# EAGLE board EEG_v3_16 (EAGLE 9.6.2), part 1 of 2
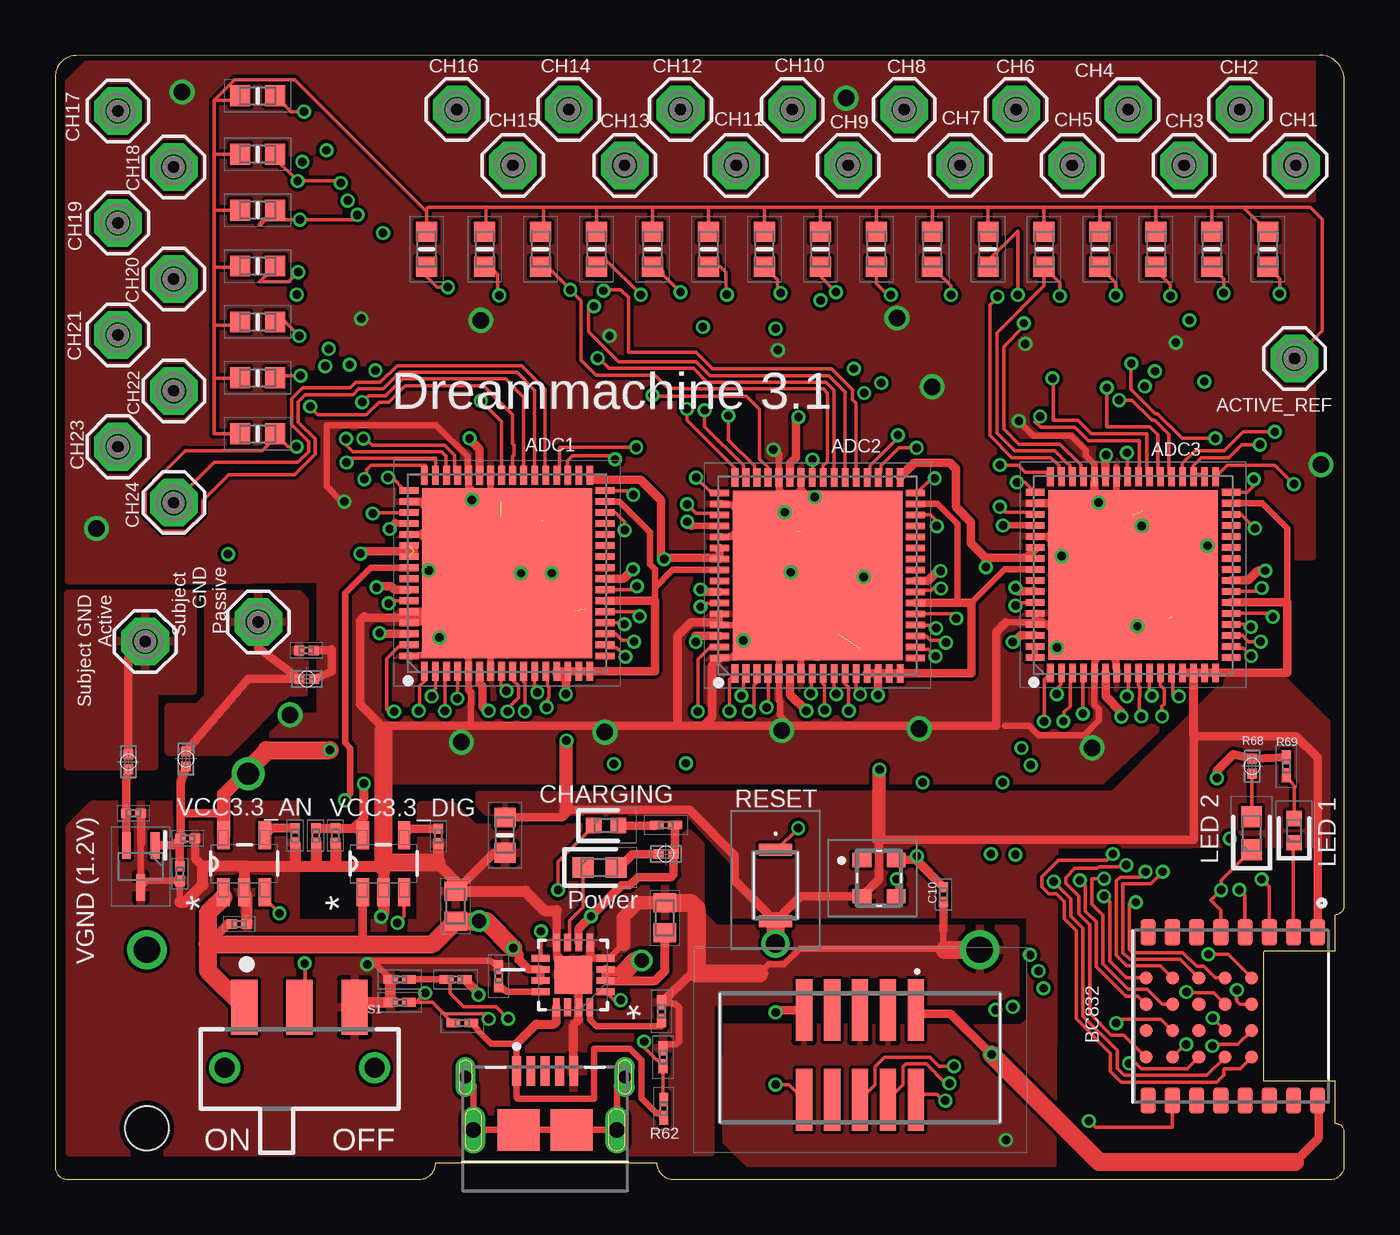
[diagram p2: board, top side]
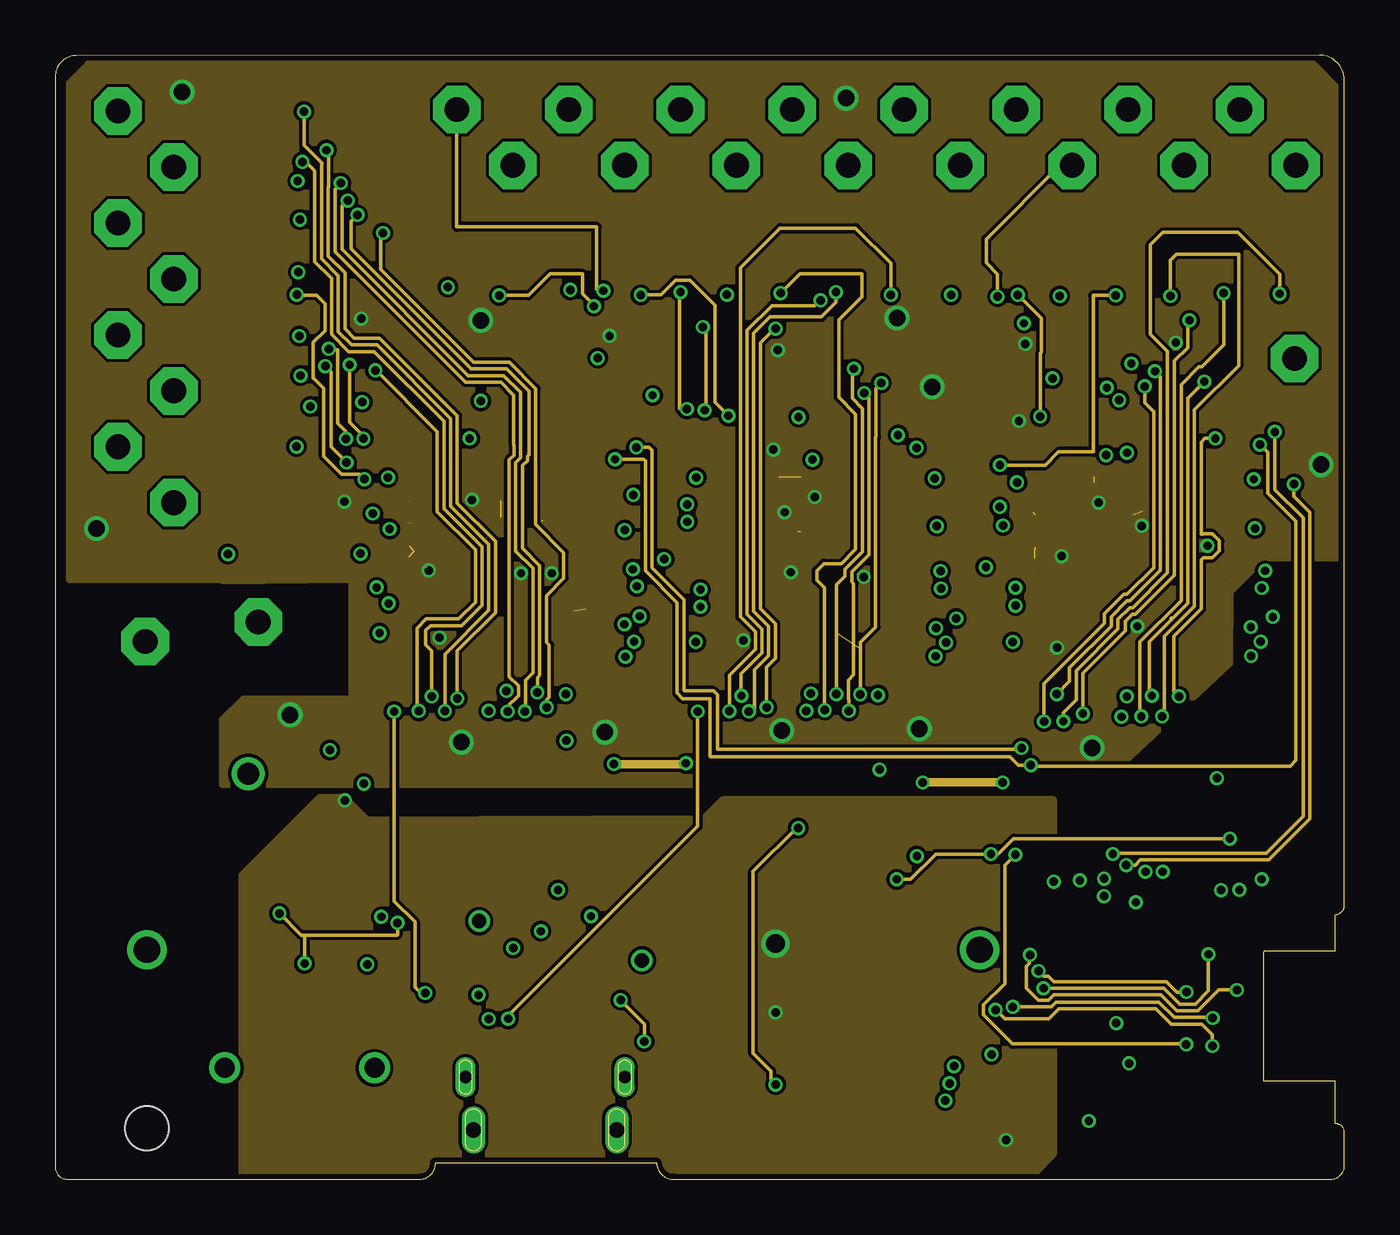
[diagram p3: board, inner layer Route2]
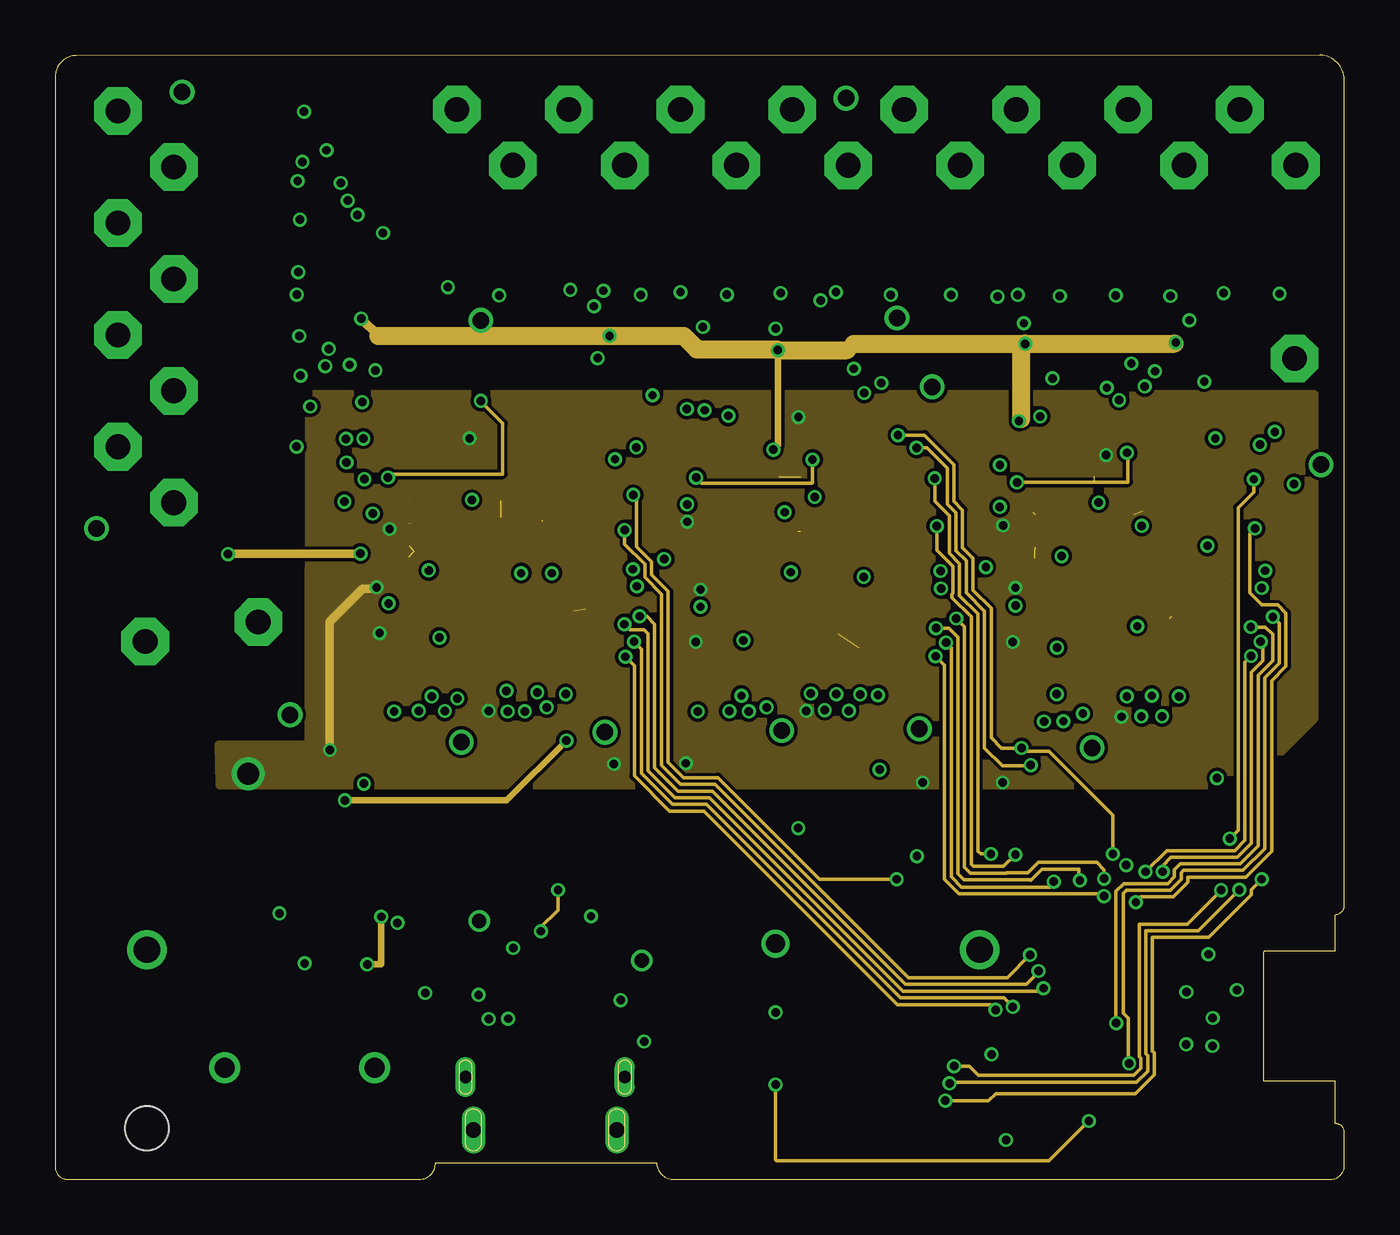
[diagram p4: board, inner layer Route15]
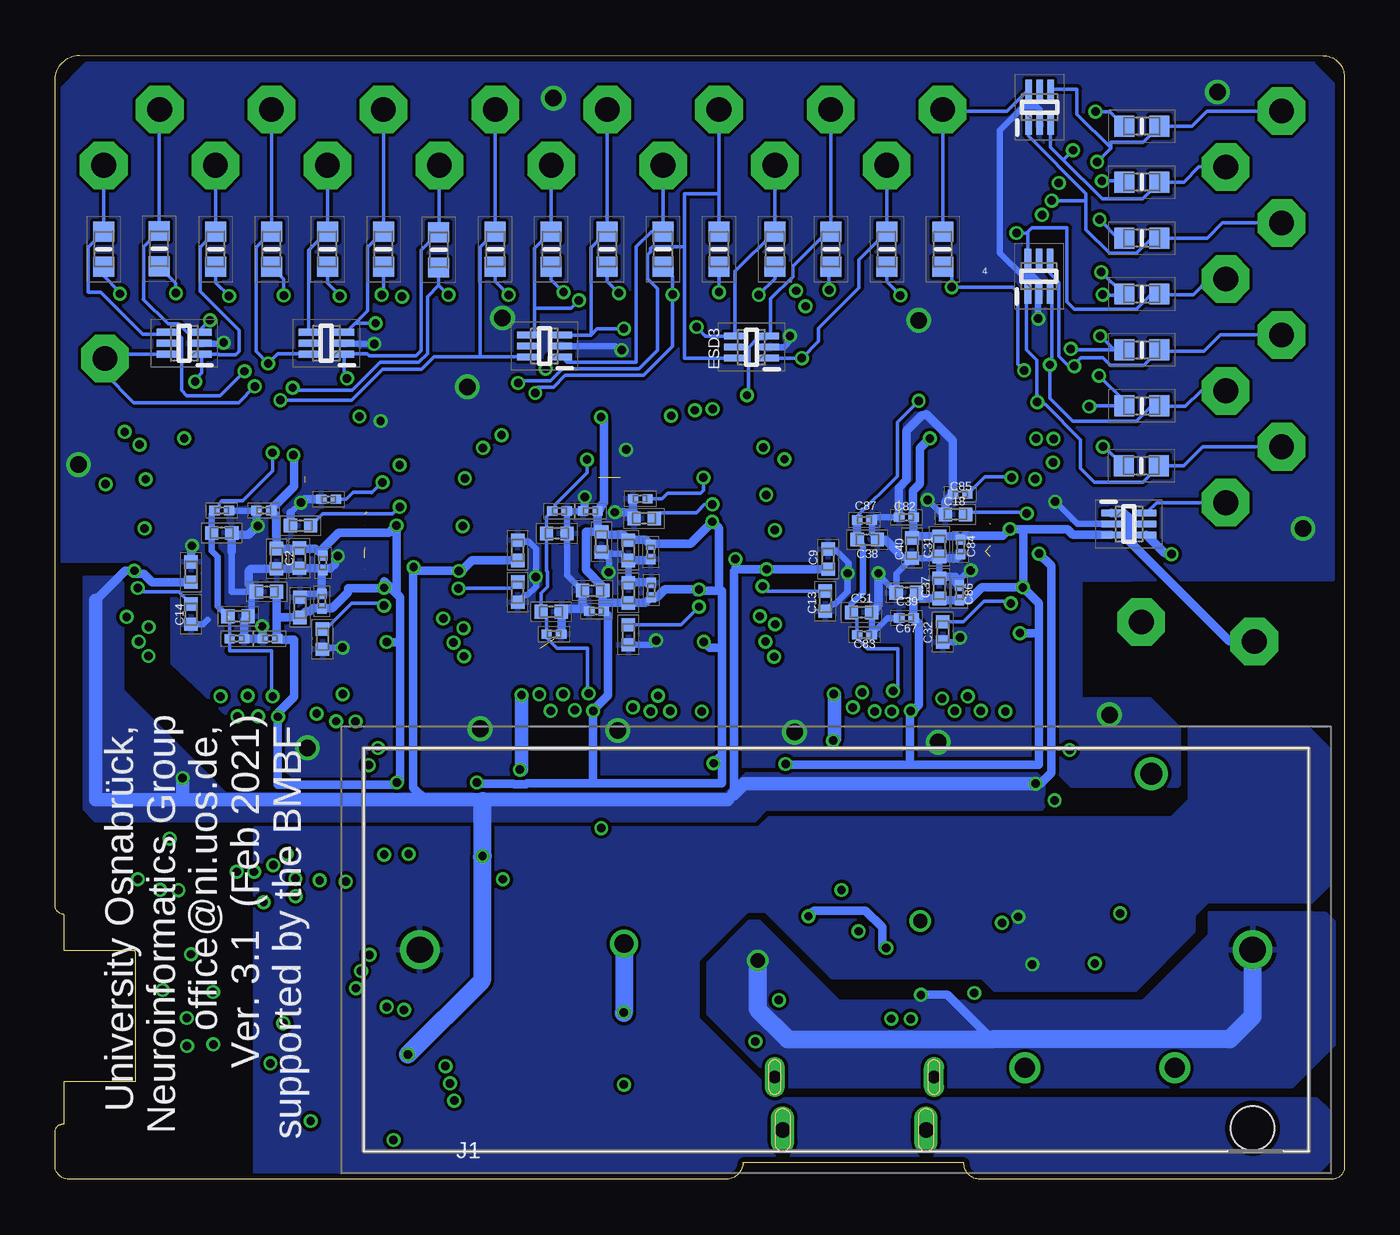
[diagram p5: board, bottom side, seen from below]

Size 58.55 x 51.03 mm. Coordinates in mm from the lower left corner, seen from the top.
Outline: 0,0.64 arc90 0.49,0 16.57,0 arc90 17.28,0.74 27.31,0.74 arc90 28.12,0 57.89,0 arc90 58.55,0.58 58.55,2.2 arc80 58.14,2.52 58.14,4.45 54.89,4.45 54.89,10.26 54.92,10.36 58.14,10.36 58.14,12.01 arc90 58.55,12.45 58.55,49.81 arc90 57.46,51.03 57.43,51.03 0.97,51 arc90 0,50.04 0,0.64
Copper layers (1+2*15+16): Top 0.018mm / dielectric 0.36mm / Route2 0.035mm / dielectric 0.71mm / Route15 0.035mm / dielectric 0.2mm / Bottom 0.018mm
Design rules "eC_4Layer_PClass6_BaseCopperO18-I35_eCDefault *": minimum track width 0.15mm, minimum drill 0.35mm, track to track 0.15mm, track to pad 0.15mm, pad to pad 0.15mm, via to via 0.15mm, smd to smd 0mil, copper to edge 0.25mm, drill to drill 0.35mm, minimum pad ring 0.175mm, minimum via ring 0.125mm, stop-mask expansion 0mil, vias tented up to drill 0.45mm, thermal gap 0.2mm
Net classes: 0 default: width 0.152 mm, drill 0.381 mm; 1 power: width 0.305 mm, drill 0.381 mm; 2 power2: width 0.381 mm, drill 0.381 mm

## Footprints (pad centres in the part's own frame; a part is rotated, then mirrored left to right if it is on the bottom)
SE11 = drill 1.118 pad 2.159 octagon: MP 0,0
QFN50P900X900X80-65N = smd 0.85 x 0.3: 1 -4.45,3.75; 2 -4.45,3.25; 3 -4.45,2.75; 4 -4.45,2.25; 5 -4.45,1.75; 6 -4.45,1.25; 7 -4.45,0.75; 8 -4.45,0.25; 9 -4.45,-0.25; 10 -4.45,-0.75; 11 -4.45,-1.25; 12 -4.45,-1.75; 13 -4.45,-2.25; 14 -4.45,-2.75; 15 -4.45,-3.25; 16 -4.45,-3.75; 33 4.45,-3.75; 34 4.45,-3.25; 35 4.45,-2.75; 36 4.45,-2.25; 37 4.45,-1.75; 38 4.45,-1.25; 39 4.45,-0.75; 40 4.45,-0.25; 41 4.45,0.25; 42 4.45,0.75; 43 4.45,1.25; 44 4.45,1.75; 45 4.45,2.25; 46 4.45,2.75; 47 4.45,3.25; 48 4.45,3.75 | smd 0.3 x 0.85: 17 -3.75,-4.45; 18 -3.25,-4.45; 19 -2.75,-4.45; 20 -2.25,-4.45; 21 -1.75,-4.45; 22 -1.25,-4.45; 23 -0.75,-4.45; 24 -0.25,-4.45; 25 0.25,-4.45; 26 0.75,-4.45; 27 1.25,-4.45; 28 1.75,-4.45; 29 2.25,-4.45; 30 2.75,-4.45; 31 3.25,-4.45; 32 3.75,-4.45; 49 3.75,4.45; 50 3.25,4.45; 51 2.75,4.45; 52 2.25,4.45; 53 1.75,4.45; 54 1.25,4.45; 55 0.75,4.45; 56 0.25,4.45; 57 -0.25,4.45; 58 -0.75,4.45; 59 -1.25,4.45; 60 -1.75,4.45; 61 -2.25,4.45; 62 -2.75,4.45; 63 -3.25,4.45; 64 -3.75,4.45 | smd 7.7 x 7.7: 65 0,0
XCVR_BC832 = smd 1.19 x 0.69: 1 -3.82,3.918; 2 -3.82,2.818; 3 -3.82,1.718; 4 -3.82,0.618; 5 -3.82,-0.482; 6 -3.82,-1.582; 7 -3.82,-2.682; 8 -3.82,-3.782; 9 3.82,-3.782; 10 3.82,-2.682; 11 3.82,-1.582; 12 3.82,-0.482; 13 3.82,0.618; 14 3.82,1.718; 15 3.82,2.818; 16 3.82,3.918 | smd 0.6 x 0.6: A1 -1.75,0.919; A2 -1.75,-0.281; A3 -1.75,-1.481; A4 -1.75,-2.681; A5 -1.75,-3.881; B1 -0.55,0.919; B2 -0.55,-0.281; B3 -0.55,-1.481; B4 -0.55,-2.681; B5 -0.55,-3.881; C1 0.65,0.919; C2 0.65,-0.281; C3 0.65,-1.481; C4 0.65,-2.681; C5 0.65,-3.881; D1 1.85,0.919; D2 1.85,-0.281; D3 1.85,-1.481; D4 1.85,-2.681; D5 1.85,-3.881
CAPC1005X33N = smd 0.6 x 0.62: 1 -0.46,0; 2 0.46,0
CAPC0603X33N = smd 0.46 x 0.42: 1 -0.33,0; 2 0.33,0
CAPC1608X100N = smd 0.87 x 1.02: 1 -0.68,0; 2 0.68,0
QFN50P300X300X100-17N = smd 0.813 x 0.305: 1 -1.473,0.762; 2 -1.473,0.254; 3 -1.473,-0.254; 4 -1.473,-0.762; 9 1.473,-0.762; 10 1.473,-0.254; 11 1.473,0.254; 12 1.473,0.762 | smd 0.305 x 0.813: 5 -0.762,-1.473; 6 -0.254,-1.473; 7 0.254,-1.473; 8 0.762,-1.473; 13 0.762,1.473; 14 0.254,1.473; 15 -0.254,1.473; 16 -0.762,1.473 | smd 1.702 x 1.702: 17 0,0
DSC1001DI50081920T = smd 0.85 x 0.65: 1 -0.775,0.825; 2 -0.775,-0.825; 3 0.775,-0.825; 4 0.775,0.825
SOT65P210X110-3N = smd 1.2 x 0.4: 1 -0.95,0.65; 2 -0.95,-0.65; 3 0.95,0
SOP50P160X60-6N = smd 0.914 x 0.3: 1 -0.798,0.5 | smd 0.904 x 0.3: 2 -0.798,0; 3 -0.798,-0.5; 4 0.798,-0.5; 5 0.798,0; 6 0.798,0.5
SHF-105-01-X-D-SM-TR = smd 0.74 x 2.795: 1 -2.54,-2.033; 2 -2.54,2.033; 3 -1.27,-2.033; 4 -1.27,2.033; 5 0,-2.033; 6 0,2.033; 7 1.27,-2.033; 8 1.27,2.033; 9 2.54,-2.033; 10 2.54,2.033
TE_2040002-1 = smd 0.4 x 1.35: 1 -1.3,2.675; 2 -0.65,2.675; 3 0,2.675; 4 0.65,2.675; 5 1.3,2.675 | smd 1.9 x 1.9: S4 -1.2,0; S5 1.2,0 | drill 0.56 long: SH1 -3.615,2.4; SH2 3.615,2.4 | drill 0.71 long: SH3 3.255,0; SH4 -3.255,0
LEDC1006X25N = smd 0.7 x 0.7: 1 -0.55,0; 2 0.55,0
LEDC1608X80N = smd 0.95 x 0.95: 1 -0.75,0; 2 0.75,0
RESC1608X55N = smd 0.9 x 0.95: 1 -0.8,0; 2 0.8,0
RESC0603X26N = smd 0.44 x 0.42: 1 -0.34,0; 2 0.34,0
RESC0603X26N' = smd 0.625 x 0.4: 1 -0.412,0; 2 0.412,0
RESC0603X28N = smd 0.625 x 0.4: 1 -0.412,0; 2 0.412,0
TL3780AF330QG = smd 0.55 x 1.5: 1 -1.625,0; 2 1.625,0
JS102011SAQN = smd 1.2 x 2.5: 1 -2.5,1; 2 0,1; 3 2.5,1 | drill 0.9 pad 1.4: 4 -3.4,-1.75; 5 3.4,-1.75
1051 = drill 1.19 pad 1.785: 1 0,0; 2 37.82,0 | hole 1.98: 0,8.1
SOT95P280X145-5N = smd 1.27 x 0.559: 1 -1.295,0.94; 2 -1.295,0; 3 -1.295,-0.94; 4 1.295,-0.94; 5 1.295,0.94

## Placement (x,y rotation side)
ACTIVE_REF  SE11  [SE11]  56.29,37.26 0 top
ADC1  AD7779ACPZ  [QFN50P900X900X80-65N]  20.53,27.51 90 top
ADC2  AD7779ACPZ  [QFN50P900X900X80-65N]  34.62,27.41 90 top
ADC3  AD7779ACPZ  [QFN50P900X900X80-65N]  48.95,27.43 90 top
BC832  BC832  [XCVR_BC832]  53.42,7.39 270 top
C1  1 uF  [CAPC1005X33N]  46.41,24.51 270 bottom
C2  1 uF  [CAPC1005X33N]  47.45,28.19 90 bottom
C3  2.2uF  [CAPC0603X33N]  12.73,15.6 90 top
C4  1 uF  [CAPC1005X33N]  52.38,27.56 90 bottom
C5  0.01uF  [CAPC0603X33N]  17.4,15.57 90 top
C6  1 uF  [CAPC1005X33N]  37.55,28.55 90 bottom
C7  1 uF  [CAPC1005X33N]  47.4,29.67 180 bottom
C8  1 uF  [CAPC1005X33N]  50.98,29.34 0 bottom
C9  1 uF  [CAPC1005X33N]  23.45,28.14 90 bottom
C10  0.01uF  [CAPC0603X33N]  40.34,12.93 90 top
C11  1 uF  [CAPC1005X33N]  47.43,25.96 90 bottom
C12  1 uF  [CAPC1005X33N]  37.55,26.65 90 bottom
C13  1 uF  [CAPC1005X33N]  23.58,26.24 90 bottom
C14  1 uF  [CAPC1005X33N]  52.38,25.65 270 bottom
C15  1 uF  [CAPC1005X33N]  31.81,30 180 bottom
C16  1 uF  [CAPC1005X33N]  48.95,26.67 0 bottom
C17  1 uF  [CAPC1005X33N]  48.49,28.17 90 bottom
C18  1 uF  [CAPC1005X33N]  17.66,30.18 180 bottom
C19  2.2uF  [CAPC0603X33N]  8.36,11.58 180 top
C20  0.1 uF  [CAPC0603X33N]  11.84,15.6 90 top
C21  1 uF  [CAPC1005X33N]  50.25,25.55 180 bottom
C22  2.2uF  [CAPC0603X33N]  3.56,16.61 180 top
C23  2.2uF  [CAPC0603X33N]  5.67,13.87 90 top
C24  1 uF  [CAPC1005X33N]  34.14,26.72 0 bottom
C25  1 uF  [CAPC1005X33N]  32.52,28.55 90 bottom
C26  1 uF  [CAPC1005X33N]  32.52,24.72 270 bottom
C27  1 uF  [CAPC1005X33N]  35.77,29.31 0 bottom
C28  1 uF  [CAPC1005X33N]  32.52,26.62 90 bottom
C29  1 uF  [CAPC1005X33N]  36.02,25.76 180 bottom
C30  1 uF  [CAPC1005X33N]  33.74,28.93 90 bottom
C31  1 uF  [CAPC1005X33N]  18.39,28.73 90 bottom
C32  1 uF  [CAPC1005X33N]  18.24,24.84 270 bottom
C33  2.2uF  [CAPC0603X33N]  11.41,24 180 top
C37  1 uF  [CAPC1005X33N]  18.39,26.82 90 bottom
C38  1 uF  [CAPC1005X33N]  21.67,29.03 0 bottom
C39  1 uF  [CAPC1005X33N]  19.89,26.62 0 bottom
C40  1 uF  [CAPC1005X33N]  19.64,28.65 90 bottom
C51  1 uF  [CAPC1005X33N]  21.92,25.73 180 bottom
C55  10 uF  [CAPC1608X100N]  27.69,11.86 270 top
C56  10 uF  [CAPC1608X100N]  18.19,12.4 270 top
C57  0.01uF  [CAPC0603X33N]  10.9,15.6 270 top
C64  0.1 uF  [CAPC0603X33N]  35.89,24.74 180 bottom
C65  0.1 uF  [CAPC0603X33N]  46.13,30.86 0 bottom
C66  0.1 uF  [CAPC0603X33N]  46.44,26.24 90 bottom
C67  0.1 uF  [CAPC0603X33N]  19.89,25.48 0 bottom
C68  0.1 uF  [CAPC0603X33N]  46.39,27.97 90 bottom
C69  0.1 uF  [CAPC0603X33N]  49.08,30.35 0 bottom
C70  0.1 uF  [CAPC0603X33N]  50.3,24.54 180 bottom
C71  0.1 uF  [CAPC0603X33N]  35.64,30.33 0 bottom
C72  0.1 uF  [CAPC0603X33N]  33.96,25.78 0 bottom
C73  0.1 uF  [CAPC0603X33N]  34.24,30.33 0 bottom
C74  0.1 uF  [CAPC0603X33N]  31.98,30.89 0 bottom
C75  0.1 uF  [CAPC0603X33N]  6.02,15.47 180 top
C77  0.1 uF  [CAPC0603X33N]  31.5,28.47 90 bottom
C78  0.1 uF  [CAPC0603X33N]  31.48,26.75 90 bottom
C79  0.1 uF  [CAPC0603X33N]  48.8,24.54 0 bottom
C81  0.1 uF  [CAPC0603X33N]  50.98,30.35 0 bottom
C82  0.1 uF  [CAPC0603X33N]  19.89,30.05 0 bottom
C83  0.1 uF  [CAPC0603X33N]  21.8,24.72 180 bottom
C84  0.1 uF  [CAPC0603X33N]  17.43,28.7 90 bottom
C85  0.1 uF  [CAPC0603X33N]  17.45,31.09 0 bottom
C86  0.1 uF  [CAPC0603X33N]  17.48,26.62 90 bottom
C87  0.1 uF  [CAPC0603X33N]  21.8,29.92 0 bottom
CH1  SE11  [SE11]  56.34,46.03 0 top
CH2  SE11  [SE11]  53.8,48.57 0 top
CH3  SE11  [SE11]  51.26,46.03 0 top
CH4  SE11  [SE11]  48.72,48.57 0 top
CH5  SE11  [SE11]  46.18,46.03 0 top
CH6  SE11  [SE11]  43.64,48.57 0 top
CH7  SE11  [SE11]  41.1,46.03 0 top
CH8  SE11  [SE11]  38.56,48.57 0 top
CH9  SE11  [SE11]  36.02,46.03 0 top
CH10  SE11  [SE11]  33.48,48.57 0 top
CH11  SE11  [SE11]  30.94,46.03 0 top
CH12  SE11  [SE11]  28.4,48.57 0 top
CH13  SE11  [SE11]  25.86,46.03 0 top
CH14  SE11  [SE11]  23.32,48.57 0 top
CH15  SE11  [SE11]  20.78,46.03 0 top
CH16  SE11  [SE11]  18.24,48.57 0 top
CH17  SE11  [SE11]  2.85,48.49 0 top
CH18  SE11  [SE11]  5.39,45.95 0 top
CH19  SE11  [SE11]  2.85,43.41 0 top
CH20  SE11  [SE11]  5.39,40.87 0 top
CH21  SE11  [SE11]  2.85,38.33 0 top
CH22  SE11  [SE11]  5.39,35.79 0 top
CH23  SE11  [SE11]  2.85,33.25 0 top
CH24  SE11  [SE11]  5.39,30.71 0 top
CHARGING  BQ24072TRGTR  [QFN50P300X300X100-17N]  23.53,9.27 180 top
CLOCK  DSC1001DI5-008.1920T  [DSC1001DI50081920T]  37.42,13.67 0 top
D1  REF3312AIDCKR  [SOT65P210X110-3N]  3.89,14.2 270 top
ESD1  TPD4E1B06DRLR  [SOP50P160X60-6N]  13.87,41 90 bottom
ESD2  TPD4E1B06DRLR  [SOP50P160X60-6N]  13.85,48.67 90 bottom
ESD3  TPD4E1B06DRLR  [SOP50P160X60-6N]  26.93,37.77 180 bottom
ESD4  TPD4E1B06DRLR  [SOP50P160X60-6N]  36.33,37.82 180 bottom
ESD5  TPD4E1B06DRLR  [SOP50P160X60-6N]  46.23,37.95 180 bottom
ESD6  TPD4E1B06DRLR  [SOP50P160X60-6N]  52.68,37.95 180 bottom
ESD7  TPD4E1B06DRLR  [SOP50P160X60-6N]  9.78,29.74 0 bottom
J1  SHF-105-01-L-D-SM-TR  [SHF-105-01-X-D-SM-TR]  36.56,5.64 180 top
J3  2040002-1  [TE_2040002-1]  22.26,2.24 0 top
LED1  SML-P11MTT86R  [LEDC1006X25N]  56.27,15.83 90 top
LED2  SML-P11MTT86R  [LEDC1006X25N]  25.02,16.05 0 top
LED3  150060RS75000  [LEDC1608X80N]  54.34,15.7 90 top
LED4  150060RS75000  [LEDC1608X80N]  24.72,14.15 0 top
R1  0 Ohm  [RESC1608X55N]  23.32,42.22 270 bottom
R2  0 Ohm  [RESC1608X55N]  9.22,32.39 180 bottom
R3  0 Ohm  [RESC1608X55N]  9.2,35.1 180 bottom
R4  0 Ohm  [RESC1608X55N]  9.2,37.64 180 bottom
R5  0 Ohm  [RESC1608X55N]  9.2,40.18 180 bottom
R6  0 Ohm  [RESC1608X55N]  9.2,42.72 180 bottom
R7  0 Ohm  [RESC1608X55N]  9.2,45.26 180 bottom
R8  0 Ohm  [RESC1608X55N]  9.2,47.8 180 bottom
R9  0 Ohm  [RESC1608X55N]  18.24,42.22 270 bottom
R10  0 Ohm  [RESC1608X55N]  20.78,42.22 270 bottom
R11  0 Ohm  [RESC1608X55N]  25.86,42.22 270 bottom
R12  0 Ohm  [RESC1608X55N]  28.4,42.22 270 bottom
R13  0 Ohm  [RESC1608X55N]  30.94,42.22 270 bottom
R14  0 Ohm  [RESC1608X55N]  33.48,42.22 270 bottom
R15  0 Ohm  [RESC1608X55N]  36.02,42.22 270 bottom
R16  0 Ohm  [RESC1608X55N]  38.56,42.22 270 bottom
R17  0 Ohm  [RESC1608X55N]  41.13,42.19 270 bottom
R18  0 Ohm  [RESC1608X55N]  43.64,42.22 270 bottom
R19  0 Ohm  [RESC1608X55N]  46.18,42.22 270 bottom
R20  0 Ohm  [RESC1608X55N]  48.72,42.22 270 bottom
R21  0 Ohm  [RESC1608X55N]  51.26,42.22 270 bottom
R22  0 Ohm  [RESC1608X55N]  53.83,42.24 270 bottom
R23  0 Ohm  [RESC1608X55N]  56.34,42.22 270 bottom
R24  0 Ohm  [RESC1608X55N]  55.07,42.22 270 top
R25  0 Ohm  [RESC1608X55N]  52.53,42.22 270 top
R26  0 Ohm  [RESC1608X55N]  49.99,42.22 270 top
R27  0 Ohm  [RESC1608X55N]  47.45,42.22 270 top
R28  0 Ohm  [RESC1608X55N]  44.91,42.22 270 top
R29  0 Ohm  [RESC1608X55N]  42.37,42.22 270 top
R30  0 Ohm  [RESC1608X55N]  39.83,42.22 270 top
R31  0 Ohm  [RESC1608X55N]  37.29,42.22 270 top
R32  0 Ohm  [RESC1608X55N]  34.75,42.22 270 top
R33  0 Ohm  [RESC1608X55N]  32.21,42.22 270 top
R34  0 Ohm  [RESC1608X55N]  29.67,42.22 270 top
R35  0 Ohm  [RESC1608X55N]  27.13,42.22 270 top
R36  0 Ohm  [RESC1608X55N]  24.59,42.22 270 top
R37  0 Ohm  [RESC1608X55N]  22.05,42.22 270 top
R38  0 Ohm  [RESC1608X55N]  19.51,42.22 270 top
R39  0 Ohm  [RESC1608X55N]  20.43,15.62 270 top
R40  0 Ohm  [RESC1608X55N]  16.87,42.22 270 top
R41  2.7 kohm  [RESC0603X26N]  27.74,14.76 0 top
R42  0 Ohm  [RESC1608X55N]  9.2,49.18 0 top
R43  2 kohm  [RESC0603X26N']  27.74,16.08 0 top
R44  0 Ohm  [RESC1608X55N]  9.2,46.53 0 top
R45  300 Ohm  [RESC0603X26N]  3.33,18.95 270 top
R46  0 Ohm  [RESC1608X55N]  9.2,43.99 0 top
R47  300 Ohm  [RESC0603X26N]  5.95,19.08 90 top
R48  0 Ohm  [RESC1608X55N]  9.2,41.45 0 top
R49  41.2 kOhms  [RESC0603X28N]  15.65,8.03 180 top
R50  0 Ohm  [RESC1608X55N]  9.2,38.91 0 top
R51  2.2 kohm  [RESC0603X28N]  20.15,9.22 270 top
R52  0 Ohm  [RESC1608X55N]  9.2,36.37 0 top
R53  3 kohm  [RESC0603X26N']  27.54,7.62 270 top
R54  0 Ohm  [RESC1608X55N]  9.2,33.83 0 top
R55  41.2kOhms  [RESC0603X28N]  18.19,9.07 0 top
R56  41.2kOhms  [RESC0603X28N]  15.65,9.07 0 top
R57  41.2kOhms  [RESC0603X28N]  18.5,7.09 0 top
R58  300 Ohm  [RESC0603X26N]  11.43,22.71 0 top
R62  200kohm  [RESC0603X28N]  27.64,3.2 270 top
R65  49.9 kOhms  [RESC0603X28N]  27.61,5.54 270 top
R68  2.7kohm  [RESC0603X26N]  54.36,18.75 90 top
R69  2 kohm  [RESC0603X26N']  55.91,18.75 90 top
RESET  TL3780AF330QG  [TL3780AF330QG]  32.72,13.34 270 top
S1  JS102011SAQN  [JS102011SAQN]  11.1,6.81 0 top
SUBJECT_GND  SE11  [SE11]  4.09,24.41 0 top
SUBJECT_GND_VD  SE11  [SE11]  9.22,25.3 0 top
U2  1051  [1051]  4.17,10.41 180 bottom
VCC3.3_AN  TPS73233DBVT  [SOT95P280X145-5N]  8.59,14.33 90 top
VCC3.3_DIG  TPS73233DBVT  [SOT95P280X145-5N]  14.91,14.33 90 top

## Tracks (layer width: path | path; a pad name or v marks a point on that pad's centre or on a via)
-CHG  (via drill 0.38)
  Top 0.152: LED2.1 22.84,14.42 v22.84,13.13 22.84,13.03 | v22.06,11.26 22.06,10.05 CHARGING.9
  Route15 0.152: v22.84,13.13 22.84,12.22 22.03,11.41 22.03,11.3 v22.06,11.26
-PGOOD
  Top 0.152: LED4.1 23.97,12.34 23.36,11.73 23.36,10.84 CHARGING.7
ADC1_IN_0+  (via drill 0.38)
  Top 0.152: ADC3.2 45.67,22.96 45.67,22.46 45.47,22.25 45.47,22.04 v45.49,22.02
  Route2 0.152: v49.95,36.68 50.19,36.43 50.19,27.64 48.81,26.25 48.67,26.25 47.96,25.54 47.96,25.11 46.07,23.21 46.07,22.6 v45.49,22.02
  Bottom 0.152: CH1.MP R23.1 57.05,42.3 57.05,40.26 56.47,40.26 54.57,38.36 53.57,38.36 ESD6.4 53.06,38.45 52.8,38.19 52.8,35.8 52.56,35.56 51.06,35.56 v49.95,36.68
ADC1_IN_0-  (via drill 0.38)
  Top 0.152: ADC3.1 44.92,22.7 v44.92,20.79 v44.91,20.78 | R38.1 19.56,43.07 19.56,44.12 | 19.56,44.12 22.18,44.12 | 22.18,44.12 24.54,44.12 | 24.54,44.12 27.21,44.12 | 27.21,44.12 29.65,44.12 | 29.65,44.12 32.21,44.12 | 32.21,44.12 34.8,44.12 | 34.8,44.12 37.29,44.12 | 37.29,44.12 39.81,44.12 | 39.81,44.12 42.37,44.12 | 42.37,44.12 44.94,44.12 | 44.94,44.12 47.55,44.12 | 47.55,44.12 50.02,44.12 | 50.02,44.12 52.46,44.12 | 52.46,44.12 53.97,44.12 | 53.97,44.12 R24.1 | R37.1 22.18,43.14 22.18,44.12 | R36.1 24.59,44.07 24.54,44.12 | R35.1 27.13,44.04 27.21,44.12 | R34.1 29.67,44.09 29.65,44.12 | R33.1 32.21,44.12 | R32.1 34.75,44.07 34.8,44.12 | R31.1 37.29,44.12 | R30.1 39.83,44.09 39.81,44.12 | R29.1 42.37,44.12 | R28.1 44.91,44.09 44.94,44.12 | R27.1 47.45,44.02 47.55,44.12 | R26.1 49.99,44.09 50.02,44.12 | R25.1 52.53,44.04 52.46,44.12 | 53.97,44.12 57,44.12 57.54,43.59 57.54,38.51 ACTIVE_REF.MP | R42.1 8.2,48.97 7.22,48.97 | 7.22,46.61 7.22,48.97 | 7.22,46.61 7.22,43.99 | 7.22,43.99 7.22,41.4 | 7.22,41.4 7.22,38.76 | 7.22,38.76 7.22,36.35 | 7.22,36.35 7.22,33.83 R54.1 | R52.1 8.37,36.35 7.22,36.35 | R50.1 8.25,38.76 7.22,38.76 | R48.1 8.35,41.4 7.22,41.4 | R46.1 7.22,43.99 | R44.1 7.29,46.53 7.22,46.61 | 7.22,48.97 8.16,49.91 10.88,49.91 16.87,43.92 | 19.56,44.12 16.95,44.12 16.87,44.04 16.87,43.92 | 16.87,43.92 R40.1
  Route2 0.152: v49.48,35.99 49.48,35.25 49.89,34.84 49.89,27.76 48.68,26.55 48.55,26.55 47.66,25.66 47.66,25.23 44.91,22.48 v44.91,20.78
  Bottom 0.152: ESD6.6 56.1,37.45 ACTIVE_REF.MP 56.29,36.58 54.97,35.26 50.22,35.26 v49.48,35.99
ADC1_IN_1+  (via drill 0.38)
  Top 0.152: ADC3.4 46.67,22.96 v46.67,21.13
  Route2 0.152: v46.67,21.13 46.67,22.96 48.6,24.89 48.6,25.33 48.92,25.64 49.06,25.64 50.83,27.42 50.83,37.15 51.44,37.75 51.44,38.86 51.52,38.94 v51.52,38.99
  Bottom 0.152: 53.8,43.07 R22.1 | CH2.MP 53.83,48.54 R22.1 | v51.52,38.99 51.89,38.62 ESD6.3 52.56,38.45 52.94,38.82 53.41,38.82 54.54,39.95 54.53,39.96 54.53,42.34 R22.1
ADC1_IN_1-  (via drill 0.38)
  Top 0.152: ADC3.3 46.1,22.88 46.1,21.48 45.82,21.19 45.82,20.81 v45.79,20.79 | 55.07,41.61 R24.2 55.6,40.88 v55.6,40.19
  Route2 0.152: v45.79,20.79 45.79,21.18 46.11,21.49 46.37,21.76 46.37,23.09 48.26,24.98 48.26,25.41 48.8,25.95 48.93,25.95 50.51,27.53 50.51,37.59 49.74,38.36 49.74,42.42 50.3,42.98 53.71,42.98 55.6,41.08 v55.6,40.19
  Bottom 0.152: R23.2 56.34,41.01 55.6,40.27 v55.6,40.19
ADC1_IN_2+  (via drill 0.38)
  Top 0.152: ADC3.10 49.7,22.14 49.8,22.03 v49.8,21.95
  Route2 0.152: v49.8,21.95 49.7,22.05 49.7,24.41 51.44,26.14 51.44,35.46 v52.19,36.21
  Bottom 0.152: CH3.MP R21.1 51.96,42.31 51.96,40.3 50.19,38.53 50.19,37.59 50.35,37.43 51.12,37.43 51.13,37.45 ESD6.1 51.9,37.44 51.9,36.6 52.19,36.31 v52.19,36.21
ADC1_IN_2-  (via drill 0.38)
  Top 0.152: ADC3.9 49.2,22.41 49.26,22.35 49.26,21.9 49.23,21.87 49.23,20.9 v49.33,21.01 | R25.2 53.06,40.88 v53.06,40.22
  Route2 0.152: v49.33,21.01 49.26,21.01 49.26,24.39 51.13,26.26 51.13,36.07 51.94,36.88 52.07,36.88 53.06,37.87 v53.06,40.22
  Bottom 0.152: R22.2 53.06,40.68 v53.06,40.22
ADC1_IN_3+  (via drill 0.38)
  Top 0.152: ADC3.12 50.75,22.93 50.75,21.92 v51.04,21.92 | v52.69,33.63 51.19,33.63 50.06,34.75 49.96,34.75 48.85,35.86 48.85,37 v48.87,37.03
  Route2 0.152: 48.75,48.54 CH4.MP | v51.04,21.92 50.8,22.15 50.8,24.65 52.04,25.89 52.04,28.12 52.14,28.21 52.55,28.21 52.87,28.53 52.87,28.98 52.55,29.3 52.1,29.3 52.1,29.29 52.04,29.29 52.04,33.46 52.22,33.63 v52.69,33.63
  Bottom 0.152: ESD5.6 47.04,37.46 48.44,37.46 v48.87,37.03 49.42,37.58 49.42,42.31 R20.1 CH4.MP
ADC1_IN_3-  (via drill 0.38)
  Top 0.152: ADC3.11 50.2,22.42 50.37,22.25 50.37,21.57 50.27,21.47 v50.27,21.01 | R26.2 49.99,41.55 49.84,41.41 50.65,40.6 v50.65,40.09
  Route2 0.152: v50.27,21.01 50.37,21.11 50.37,24.64 51.74,26.01 51.74,34.92 53.75,36.93 53.75,41.98 50.91,41.98 50.65,41.72 v50.65,40.09 50.7,40.05
  Bottom 0.152: R21.2 51.26,40.7 v50.65,40.09
ADC1_IN_4+  (via drill 0.38)
  Top 0.152: ADC3.47 45.58,32.01 45.58,32.4 45.22,32.76 43.45,32.76 42.45,33.76 42.45,39.68 42.79,40.02 v42.79,40.06
  Route2 0.152: CH5.MP 45.63,46.03 42.29,42.68 42.29,41.6 42.79,41.09 v42.79,40.06
  Bottom 0.152: 47.13,38.45 ESD5.4 47.03,42.17 R19.1 CH5.MP
ADC1_IN_4-  (via drill 0.38)
  Top 0.152: R27.2 48.16,40.7 v48.16,40.12 | ADC3.48 45,32.08 44.07,32.08 43.73,32.42 v42.9,32.42
  Route2 0.152: v42.9,32.42 44.97,32.42 45.56,33.01 47.14,33.01 47.15,33.02 47.15,40.12 v48.16,40.12
  Bottom 0.152: R20.2 48.16,40.86 v48.16,40.12
ADC1_IN_5+  (via drill 0.38)
  Top 0.152: ADC3.45 46.58,32.01 46.58,32.43 45.63,33.37 43.77,33.37 43.08,34.06 43.08,37.79 44,38.71 v44,38.86
  Bottom 0.152: CH6.MP R18.1 44.35,42.3 44.35,39.42 44.92,38.86 | 45.49,38.5 ESD5.3 45.33,38.45 44.92,38.86 | v44,38.86 44.92,38.86
ADC1_IN_5-  (via drill 0.38)
  Top 0.152: 45.62,40.21 v45.62,40.09 45.62,40.7 R28.2 44.91,40.55 42.77,38.41 42.77,33.89 43.59,33.07 45.39,33.07 45.93,32.53 45.94,32.53 46.08,32.4 46.08,32.01 ADC3.46
  Route15 0.152: 45.65,40.07 v45.62,40.09
  Bottom 0.152: R19.2 46.18,40.68 45.61,40.11 v45.62,40.09
ADC1_IN_6+  (via drill 0.38)
  Top 0.152: ADC3.39 49.58,32.01 49.58,33.85 47.06,33.85 46.44,34.46 45.34,34.46 45.34,36.3 v45.29,36.35
  Bottom 0.152: CH7.MP 41.1,43.02 R17.1 41.94,42.18 41.94,37.6 42.16,37.38 44.28,37.38 44.37,37.47 45.41,37.47 ESD5.1 45.43,36.49 v45.29,36.35
ADC1_IN_6-  (via drill 0.38)
  Top 0.152: R29.2 42.37,41.68 43.72,43.03 v43.72,40.14 | ADC3.40 49.2,32.3 49.24,32.35 49.24,33.52 46.93,33.52 46.31,34.14 44.76,34.14 44.51,34.39 v44.73,34.62
  Route2 0.152: v44.73,34.62 44.73,37.49 44.78,37.54 44.78,39.08 v43.72,40.14
  Bottom 0.152: v43.72,40.14 43.64,40.22 R18.2
ADC1_IN_7+  (via drill 0.38)
  Top 0.152: ADC3.37 50.58,32.01 50.58,33.81 49.94,34.45 49.82,34.45 48.9,35.37 v48.32,35.37
  Bottom 0.152: ESD4.6 37.15,37.34 39.25,37.34 | v48.31,35.37 v48.32,35.37 45.08,35.37 43.68,36.78 41.91,36.78 41.34,37.34 39.25,37.34 | 39.25,37.34 39.26,37.36 39.26,42.31 R16.1 CH8.MP
ADC1_IN_7-  (via drill 0.38)
  Top 0.152: R30.2 40.69,40.56 v40.69,40.14 | ADC3.38 50.08,32.01 50.08,33.78 49.71,34.15 47.76,34.15 v47.76,35.93
  Bottom 0.152: v40.69,40.14 41.13,40.58 R17.2 41.13,40.58 41.63,40.07 41.63,37.48 42.03,37.08 43.8,37.08 45.07,35.81 47.64,35.81 v47.76,35.93
ADC2_IN_0+  (via drill 0.38)
  Top 0.152: ADC2.2 31.27,22.86 31.27,21.95 v31.17,21.95
  Route2 0.152: v31.17,21.95 31.14,21.97 31.14,22.94 32.1,23.89 32.1,24.97 31.42,25.65 31.42,38.53 32.55,39.66 34.48,39.66 34.72,39.89 v34.76,39.89
  Bottom 0.152: CH9.MP R15.1 36.78,42.25 36.78,39.57 | ESD4.4 36.78,38.32 36.78,39.57 | v34.76,39.89 35.12,39.54 36.75,39.54 36.78,39.57
ADC2_IN_0-  (via drill 0.38)
  Top 0.152: v30.62,21.25 30.62,22.7 ADC2.1 | R31.2 37.29,40.64 37.79,40.14 v37.95,40.14
  Route2 0.152: v30.62,21.25 30.62,22.87 31.8,24.05 31.8,24.85 31.12,25.53 31.12,41.37 32.93,43.18 36.35,43.18 37.95,41.58 v37.95,40.14
  Bottom 0.152: R16.2 38.56,40.75 v37.95,40.14
ADC2_IN_1+  (via drill 0.38)
  Top 0.152: ADC2.4 32.37,22.7 32.41,22.73 32.41,21.51 v32.31,21.42
  Route2 0.152: v32.31,21.42 32.31,23.25 32.71,23.64 32.71,25.22 32.03,25.9 32.03,37.97 32.67,38.61 v32.72,38.61
  Bottom 0.152: CH10.MP R14.1 34.22,42.28 34.22,38.32 | 34.22,38.32 ESD4.3 | v32.72,38.61 33.93,38.61 34.22,38.32
ADC2_IN_1-  (via drill 0.38)  (1 unrouted)
  Top 0.152: ADC2.3 31.87,22.55 31.75,22.42 31.75,21.48 v31.51,21.24 | R32.2 34.75,40.98 v35.46,40.27
  Route2 0.152: v31.51,21.24 31.76,21.24 31.76,23.13 32.4,23.77 32.4,25.1 31.72,25.78 31.72,38.4 32.47,39.15 34.81,39.15 35.46,39.8 v35.46,40.27
  Bottom 0.152: R15.2 36.02,40.83 v35.46,40.27
ADC2_IN_2+  (via drill 0.38)
  Top 0.152: ADC2.10 35.37,22.02 v35.48,22.02
  Route2 0.152: v35.48,22.02 35.48,26.98 35.88,27.38 35.88,27.69 36.66,28.47 36.66,33.02 | 36.66,33.02 | 36.66,33.02 36.66,34.99 36.2,35.44 36.2,36.71 v36.28,36.79
  Bottom 0.152: CH11.MP R13.1 31.47,43.02 32.16,42.33 32.16,37.11 32.18,37.09 35.3,37.09 ESD4.1 36.12,37.32 36.12,36.99 36.28,36.84 v36.28,36.79
ADC2_IN_2-  (via drill 0.38)
  Top 0.152: ADC2.9 34.87,22.49 34.94,22.43 34.94,21.55 34.93,21.54 34.93,21.31 v34.95,21.29 | R33.2 32.8,40.83 32.8,40.37 v32.95,40.22
  Route2 0.152: v34.95,21.29 34.94,21.3 34.94,26.84 34.6,27.18 34.6,27.63 34.91,27.95 35.7,27.95 36.35,28.6 36.35,32.89 36.35,32.9 36.35,34.73 35.59,35.5 35.59,39.01 36.63,40.06 36.63,41.1 33.83,41.1 v32.95,40.22
  Bottom 0.152: R14.2 33.48,40.75 v32.95,40.22
ADC2_IN_3+  (via drill 0.38)
  Top 0.152: ADC2.12 36.37,22.23 36.56,22.04 v36.56,22.01
  Route2 0.152: v36.56,22.01 36.56,24.36 37.26,25.06 37.26,33.67 37.29,33.7 37.29,35.91 v37.52,36.14
  Bottom 0.152: ESD3.6 29.96,37.27 29.96,42.34 | 29.96,42.34 29.96,44.73 28.4,44.73 CH12.MP R12.1 | 29.96,42.34 31.43,42.34 31.5,42.27 31.5,42.1 31.64,41.96 31.64,40.87 31.2,40.42 31.2,37.64 32.04,36.79 35.51,36.79 36.05,36.25 37.42,36.25 v37.52,36.14
ADC2_IN_3-  (via drill 0.38)
  Top 0.152: ADC2.11 35.87,22.49 36.02,22.34 36.02,21.79 | R34.2 30.22,41.42 30.46,41.17 30.46,40.21 v30.51,40.16 | 36.03,21.77 36.02,21.79 | 36.02,21.79 36.02,21.29 v36.05,21.26
  Route2 0.152: v36.05,21.26 36.05,21.76 36.02,21.79 36.02,22.66 36.26,22.9 36.26,27.04 36.18,27.12 36.18,27.57 36.96,28.35 36.96,35.79 36.94,35.81 36.87,35.81 v36.74,35.69
  Bottom 0.152: R13.2 30.51,40.98 v30.51,40.16 30.51,37.82 31.84,36.49 35.38,36.49 35.93,35.94 36.64,35.94 36.8,35.79 36.8,35.74 v36.74,35.69
ADC2_IN_4+  (via drill 0.38)
  Top 0.152: ADC2.47 31.25,31.98 31.25,32.4 29.5,34.15 v29.5,34.91
  Route2 0.152: v29.42,38.68 29.57,38.68 29.57,34.98 v29.5,34.91
  Bottom 0.152: CH13.MP R11.1 27.66,41.21 27.66,38.33 ESD3.4 29,38.27 v29.42,38.68
ADC2_IN_4-  (via drill 0.38)
  Top 0.152: R35.2 27.41,41.42 27.61,41.21 27.61,41.06 v28.4,40.27 | ADC2.48 30.87,32.26 28.69,34.44 v28.69,34.96
  Route2 0.152: v28.69,34.96 28.36,34.96 28.36,40.23 v28.4,40.27
  Bottom 0.152: v28.4,40.27 R12.2
ADC2_IN_5+  (via drill 0.38)
  Top 0.152: ADC2.45 32.37,32.31 32,32.69 32,34.94 31.4,35.54 27.18,35.54 v27.13,35.59
  Bottom 0.152: CH14.MP R1.1 23.47,43.02 25.05,41.44 25.05,40.98 26.05,39.97 26.05,38.35 ESD3.3 26.25,38.15 26.68,38.15 27.05,37.77 27.05,37.03 27.06,37.02 27.06,35.66 v27.13,35.59
ADC2_IN_5-  (via drill 0.38)
  Top 0.152: R36.2 24.96,41.78 v26.6,40.14 | ADC2.46 31.75,31.98 31.75,32.38 30.56,33.56 30.57,33.58 v30.57,34.66
  Route2 0.152: v30.57,34.66 29.97,35.27 29.97,39.68 28.83,40.81 28.18,40.81 27.51,40.14 v26.6,40.14
  Bottom 0.152: v26.6,40.14 25.86,40.88 R11.2
ADC2_IN_6+  (via drill 0.38)
  Top 0.152: ADC2.39 35.37,35.81 35.01,36.17 29.61,36.17 28.98,36.8 25.15,36.8 24.69,37.27 v24.64,37.27
  Bottom 0.152: CH15.MP R10.1 22.05,41.75 22.05,40.46 23.88,38.63 23.88,38.03 v24.64,37.27 ESD3.1
ADC2_IN_6-  (via drill 0.38)
  Top 0.152: 22.05,41.61 R37.2 22.35,41.42 v23.4,40.37 23.89,39.88 23.89,37.18 24.57,36.5 27.24,36.5 27.82,35.91 28.4,35.91 28.44,35.87 34.88,35.87 35.07,35.68 35.07,32.58 34.87,32.38 ADC2.40
  Bottom 0.152: R1.2 23.4,41.34 v23.4,40.37
ADC2_IN_7+  (via drill 0.38)
  Top 0.152: ADC2.37 36.37,35.22 36.2,35.39 36.2,35.84 35.26,36.78 29.86,36.78 29.11,37.53 26.05,37.53 26.05,40.03 25.69,40.38 24.95,40.38 v24.9,40.33
  Route2 0.152: v24.9,40.33 24.83,40.41 24.59,40.41 24.59,43.23 18.24,43.23 CH16.MP
  Bottom 0.152: CH16.MP 18.24,48.49 | 18.24,48.49 R9.1 | 18.24,48.49 15.32,48.49 ESD2.6
ADC2_IN_7-  (via drill 0.38)
  Top 0.152: R38.2 19.63,41.54 20.1,41.07 20.1,40.19 v20.17,40.12 | ADC2.38 35.87,35.72 35.88,35.73 35.13,36.48 29.74,36.48 29.11,37.11 25.59,37.11 24.22,38.47 24.22,39.55 24.3,39.63 v24.47,39.63
  Route2 0.152: v24.47,39.63 24.47,39.68 23.96,40.2 23.96,41.1 22.47,41.1 21.49,40.12 v20.17,40.12
  Bottom 0.152: R10.2 20.78,40.73 v20.17,40.12
ADC3_IN_0+  (via drill 0.38)
  Top 0.152: ADC1.2 17.28,22.28 17.11,22.11 v17.11,21.91
  Route2 0.152: v17.11,21.91 17.11,23.99 16.84,24.26 16.84,24.91 17.05,25.13 18.46,25.13 19.39,26.06 19.39,28.71 17.66,30.43 17.66,34.4 14.49,37.57 13.34,37.57 12.56,38.35 12.56,40.89 11.8,41.65 11.8,45.76 11.74,45.82 11.69,45.87 11.38,46.18 v11.23,46.18
  Bottom 0.152: CH17.MP 6.25,48.49 6.94,47.8 R8.1 9.14,47.07 10.62,47.07 10.62,46.81 | 10.62,46.81 12.15,48.34 12.15,49.48 13.33,49.48 ESD2.4 | v11.23,46.18 10.62,46.79 10.62,46.81
ADC3_IN_0-  (via drill 0.38)
  Top 0.152: ADC1.1 16.78,22.61 16.56,22.39 16.56,21.56 16.39,21.39 v16.51,21.26 | R40.2 16.87,40.97 17.35,40.49 17.36,40.49 v17.84,40.49
  Route2 0.152: v16.51,21.26 16.44,21.34 16.44,25.02 16.85,25.43 18.33,25.43 19.09,26.19 19.09,28.58 17.36,30.31 17.36,33.94 14.56,36.74 v14.55,36.72
  Bottom 0.152: 18.32,41.34 R9.2 17.84,41.42 v17.84,40.49 15.05,40.49 14.83,40.27 14.83,37 v14.55,36.72
ADC3_IN_1+  (via drill 0.38)
  Top 0.152: ADC1.4 18.28,22.24 18.28,21.83 v18.27,21.82
  Route2 0.152: v18.27,21.82 18.27,23.98 19.99,25.71 19.99,28.96 18.27,30.68 18.27,34.65 14.74,38.17 13.59,38.17 13.16,38.6 13.16,41.14 12.4,41.9 12.4,45.03 12.42,45.06 12.42,46.61 v12.32,46.71
  Bottom 0.152: CH18.MP 6.61,45.95 7.29,45.26 R7.1 9.16,44.5 11,44.5 12.81,46.3 | 12.81,46.3 13.35,46.85 ESD2.3 | v12.32,46.71 12.73,46.3 12.81,46.3
ADC3_IN_1-  (via drill 0.38)
  Top 0.152: R42.2 10.71,48.46 v11.3,48.46 | v17.7,21.25 17.7,22.98 ADC1.3
  Route2 0.152: 12.12,46.13 12.1,46.15 | v11.3,48.46 11.3,46.95 12.06,46.19 12.1,46.15 | v17.7,21.25 17.7,23.84 19.69,25.83 19.69,28.83 17.96,30.56 17.96,34.52 14.62,37.87 13.52,37.87 13.46,37.87 12.86,38.47 12.86,41.01 12.1,41.77 12.1,46.15
  Bottom 0.152: R8.2 10.66,48.46 v11.3,48.46 11.13,48.46
ADC3_IN_2+  (via drill 0.38)
  Top 0.152: ADC1.10 21.28,22.58 21.34,22.52 21.34,21.62 v21.34,21.24 v21.33,21.23
  Route2 0.152: v21.33,21.23 21.36,21.26 21.36,22.65 21.7,23 21.7,27.73 20.92,28.51 20.92,32.53 21.14,32.75 21.14,35.72 20.38,36.48 18.77,36.48 13.03,42.22 13.03,44.2 13.26,44.43 v13.29,44.43
  Bottom 0.152: CH19.MP 5.54,43.41 6.23,42.72 R6.1 8.75,42.72 9.46,42.02 10.66,42.02 11.73,43.1 11.73,44.43 | 14.33,48.01 14.35,47.99 ESD2.1 14.35,47.36 11.73,44.74 11.73,44.43 | v13.29,44.43 11.73,44.43
ADC3_IN_2-  (via drill 0.38)
  Top 0.152: ADC1.9 20.78,22.65 21.04,22.39 21.04,21.85 20.55,21.36 v20.55,21.23 | v12.97,45.22 12.88,45.31 v11.02,45.31 10,46.33 R44.2
  Route2 0.152: v20.55,21.23 20.55,21.46 21.04,21.94 21.04,22.39 20.62,22.81 20.62,32.65 20.84,32.87 20.84,33.32 20.83,33.33 20.83,35.6 20.25,36.18 18.64,36.18 12.73,42.09 | v12.97,45.22 12.97,45.18 12.73,44.93 12.73,42.09 | 12.73,42.09
  Bottom 0.152: v11.02,45.31 10.05,45.31 R7.2 10.1,45.16
ADC3_IN_3+  (via drill 0.38)
  Top 0.152: ADC1.12 22.36,22.98 22.36,22.41 22.44,22.32 22.44,21.87 22.36,21.79 22.36,21.44 22.34,21.42 v22.33,21.42
  Route2 0.152: v22.33,21.42 22.33,21.76 22.44,21.87 22.44,24.25 22.31,24.38 22.31,26.49 23.1,27.28 23.1,28.44 21.82,29.72 21.82,35.89 20.63,37.08 19.02,37.08 14.79,41.31 14.79,42.85 v14.89,42.95
  Bottom 0.152: CH20.MP 6.15,40.87 6.86,40.16 8.37,40.16 R5.1 8.75,40.18 9.46,39.48 12.26,39.48 12.6,39.83 12.6,43.18 14.2,43.18 14.37,43.01 | 14.37,43.01 ESD1.6 | v14.89,42.95 14.43,42.95 14.37,43.01
ADC3_IN_3-  (via drill 0.38)
  Top 0.152: 21.78,22.25 21.9,22.12 v21.9,22.1 21.78,22.22 ADC1.11 | R46.2 9.36,43.36 9.28,43.36 9.48,43.56 v11.12,43.56 13.73,43.56 v13.73,43.77
  Route2 0.152: v21.9,22.1 21.9,22.76 22.01,22.87 22.01,27.86 21.23,28.64 21.23,32.4 21.45,32.62 21.45,32.82 21.52,32.89 21.52,35.77 20.5,36.78 18.89,36.78 13.44,42.23 13.44,43.48 v13.73,43.77
  Bottom 0.152: v11.12,43.56 10.28,42.72 R6.2
ADC3_IN_4+  (via drill 0.38)
  Top 0.152: ADC1.47 17.28,32.72 13.42,32.72 v13.24,32.54
  Route2 0.152: v13.24,32.54 12.53,33.25 12.53,36.65 v12.27,36.91
  Bottom 0.152: ESD1.4 13.37,41.12 12.97,40.72 12.97,37.35 12.56,36.94 12.32,36.94 | 12.32,36.94 12.24,36.94 v12.27,36.91 | CH21.MP 5.64,38.33 6.38,37.59 8.35,37.59 R4.1 9.1,36.94 10.63,36.94 10.98,37.29 11.98,37.29 12.32,36.94
ADC3_IN_4-  (via drill 0.38)
  Top 0.152: R48.2 9.29,40.74 10.61,40.74 v11.04,41.17 | ADC1.48 16.78,32.4 16.79,32.42 14.36,32.42 14.15,32.21 14.15,31.8 14.13,31.78 v14.04,31.78
  Route2 0.152: v14.04,31.78 13.83,31.99 13.01,31.99 12.2,32.81 12.2,35.92 11.75,36.36 11.73,36.36 11.73,37.99 12.25,38.51 12.25,39.75 11.87,40.13 10.95,40.13 | 10.95,40.13 v10.98,40.16 | 10.95,40.13
  Bottom 0.152: v11.04,41.17 10.05,40.18 R5.2 10.05,40.13 10.98,40.13 v10.98,40.16
ADC3_IN_5+  (via drill 0.38)
  Top 0.152: ADC1.45 18.15,32.08 18.15,32.85 17.68,33.32 14.41,33.32 14.11,33.62 v14,33.62
  Route2 0.152: v14,33.62 14,33.74 13.38,34.37 v13.38,36.97
  Bottom 0.152: CH22.MP 6.51,35.79 7.22,35.08 8.37,35.08 R3.1 8.75,35.1 9.46,34.4 12.33,34.4 13.38,35.45 v13.38,36.97 13.3,36.97 13.3,40.12 ESD1.3
ADC3_IN_5-  (via drill 0.38)
  Top 0.152: v11.09,38.28 10.46,38.91 R50.2 | ADC1.46 17.76,31.98 17.76,32.82 17.56,33.02 13.52,33.02 13.21,33.33 v13.21,33.61
  Route2 0.152: v13.21,33.61 13.21,33.93 12.83,34.32 12.83,37.64 12.48,37.64 v12.43,37.69
  Route15 0.152: 11.12,38.3 v11.09,38.28
  Bottom 0.152: v12.43,37.69 12.38,37.64 R4.2 | R4.2 | v11.09,38.28 10.46,37.64 R4.2
ADC3_IN_6+  (via drill 0.38)
  Top 0.152: ADC1.39 21.28,35.5 20.45,36.33 15.78,36.33 15.02,35.57 14.24,35.57 v13.95,35.28
  Bottom 0.152: CH23.MP 6.43,33.25 7.29,32.39 R2.1 9.16,31.65 11.36,31.65 11.99,32.28 11.99,33.58 13.58,35.17 13.95,35.17 v13.95,35.28 13.95,35.62 13.97,35.64 | ESD1.1 14.45,40.12 14.45,37.66 13.97,37.18 13.97,35.64 | 13.97,35.64 13.97,35.56
ADC3_IN_6-  (via drill 0.38)
  Top 0.152: R52.2 10.1,36.47 v11.14,36.47 | ADC1.40 20.78,32.81 20.84,32.87 20.84,33.32 20.78,33.38 20.78,34.7 19.45,36.02 15.9,36.02 15.15,35.27 14.71,35.27 14.13,34.7 11.92,34.7 11.59,35.03 v11.59,35.08
  Bottom 0.152: v11.14,36.47 10,35.33 R3.2 11.54,35.1 11.55,35.12 v11.59,35.08
ADC3_IN_7+
  Top 0.152: ADC1.37 22.28,32.03 22.25,32.06 22.25,35.87 21.19,36.93 15.53,36.93 14.77,36.17 13.65,36.17 13.4,35.92 11.24,35.92 10.74,35.43 10.74,34.25 11.51,33.48 11.51,33.03 11.01,32.54 7.22,32.54 CH24.MP
  Bottom 0.152: CH24.MP 8.52,30.71 ESD7.6
ADC3_IN_7-  (via drill 0.38)
  Top 0.152: ADC1.38 21.78,35.82 20.97,36.63 15.65,36.63 14.9,35.87 13.78,35.87 13.53,35.62 11.36,35.62 11.05,35.3 11.05,34.37 11.81,33.61 11.81,32.91 10.88,31.98 7.88,31.98 6.69,30.8 6.69,30.17 5.93,29.4 4.85,29.4 4.08,30.17 4.08,31.25 5.9,33.07 9.4,33.07 10,33.67 R54.2 10.57,33.26 v10.97,33.26
  Bottom 0.152: v10.97,33.26 10.9,33.26 R2.2
AGND  (via drill 0.38, 0.75)  (11 unrouted)
  Top 0.305: v22.56,27.51 22.56,26.62 21.67,26.62 | ADC1.65 v21.16,27.51 | 17.48,24.59 17.25,24.59 17.05,24.79 16.8,24.55 16.8,23.98 | 16.15,25.33 ADC1.61 | 16.84,28.14 16.84,27.78 | ADC2.64 30.22,23.7 30.72,23.7 31.2,24.18 31.2,24.4 v31.26,24.46 | ADC2.60 ADC2.61 30.82,25.16 31.26,24.71 v31.26,24.46 | 31.68,24.46 v31.26,24.46 | 24.08,25.88 24.08,26.37 24.19,26.26 | ADC1.44 18.78,31.52 18.75,31.55 | ADC1.42 19.78,31.06 19.17,31.06 18.75,31.49 18.75,31.55 | ADC2.5 32.87,24.11 32.87,24.1 ADC2.5 | 31.09,29.16 30.61,29.16 | 30.61,29.16 ADC2.53 | v36.72,27.34 36.34,27.34 36.28,27.41 ADC2.65 | 33.41,30.28 v33.13,30.28 32.87,30.53 32.87,31.67 32.88,31.66 32.88,31.35 33.1,31.13 33.65,31.13 33.87,31.35 34.56,30.66 | 37.22,24.81 36.52,24.11 | ADC1.7 19.78,23.94 19.77,23.95 19.79,23.98 19.79,23.78 19.78,23.77 ADC1.7 | ADC3.7 48.2,23.19 | 48.2,23.19 48.2,24.37 48.19,24.38 47.3,24.38 47.17,24.26 47.17,25.15 47.05,25.27 46.95,25.18 | ADC3.61 45.56,25.18 45.65,25.27 | 45,25.18 45.23,25.18 45.9,24.51 45.9,24.78 45.48,25.21 44.53,25.21 ADC3.61 | ADC3.61 ADC3.60 | v34.5,30.97 34.02,30.97 33.87,30.82 | ADC1.7 19.78,23.79 19.59,23.98 18.77,23.98 18.77,23.62 | ADC1.44 18.75,31.96 18.75,31.55 | ADC3.42 48.2,31 48.19,30.99 | ADC2.50 30.22,30.61 30.72,30.61 30.9,30.43 30.9,29.38 30.72,29.2 30.66,29.2 30.61,29.16 | 16.64,29.27 16.42,29.27 16.41,29.26 ADC1.53 16.58,29.26 16.8,29.03 16.8,28.95 17.28,28.47 | R65.1 27.79,6.12 28.2,6.12 28.33,6.25 28.33,7.8 28.16,7.96 R53.1 | 25.81,10.64 25.81,10.68 25.16,10.03 CHARGING.4 23.96,10.03 23.78,9.86 22.94,9.86 22.76,10.03 CHARGING.8 22.82,10.69 22.82,10.21 23.52,9.5 CHARGING.17
  Top 0.305: VCC3.3_AN.2 | R56.1 15.19,9.12 | R56.1 15.11,9.2 | R56.1 14.55,9.75 v14.18,9.75 14.35,9.93 19.78,9.93 R51.1 | 47.2,30.52 v47.39,30.71 | v18.93,30.84 18.93,31.3 18.78,31.46 ADC1.44 | 48.48,27.9 48.38,28 48.2,28.18 | ADC3.42 48.2,30.91 48.95,30.16 | 16.85,27.76 v16.97,27.64 | ADC3.5 | 48.2,23.19 48.15,23.24 48.15,23.53 47.98,23.71 47.42,23.71 47.21,23.49 ADC3.5 | ADC3.5 | v45.5,24.13 45.33,24.3 45.33,24.86 45,25.18 | 45,25.18 44.82,25.36 44.53,25.36 | 45.47,29.6 45.06,29.18 ADC3.53 45,29.18 45.23,28.96 45.23,28.76 v45.71,28.28 | 43.17,25.27 44.4,25.27 | ADC1.64 16.47,23.76 16.5,23.79 16.65,23.79 v17.45,24.59 | ADC1.44 18.73,32.01 18.73,32.81 17.31,34.24 12.32,34.24 12.32,31.45 13.01,30.76 v13.14,30.76 | ADC3.42 48.2,32.33 | ADC3.44 47.2,32.46 46.82,32.84 46.82,33.1 46.77,33.14 | 46.77,33.14 | 46.77,33.14 46.16,33.76 44.43,33.76 v43.77,34.42 | 32.85,32.89 32.87,32.87 ADC2.44 | 18.77,23.62 ADC1.5 18.78,23.05 18.78,22.18 18.88,22.08 18.88,21.56 18.88,21.55 18.88,20.57 | 18.77,23.62 17.68,24.71 17.68,25.48 | ADC2.65 33.56,27.41 v33.41,27.55 | ADC2.7 33.87,23.96 33.91,24 33.91,24.16 34.62,24.87 ADC2.65 | 3.92,15.27 3.89,15.24 D1.3 4.18,13.54 C23.1 5.67,12.57 | ADC3.5 47.2,21.54 47.4,21.34 47.4,20.83 46.73,20.16 44.66,20.16 44.24,20.57 43.13,20.57 | ADC2.5 32.87,22.02 32.87,21.73 32.93,21.67 32.93,21.05 33.41,20.57 | 40.34,11.33 40.34,10.47 33.82,10.47 33.11,9.75 32.39,9.75 31.98,9.35
  Top 0.381: 16.64,29.27 16.84,29.47 16.84,30.55 16.64,30.75 16.09,30.75 | ADC3.50 45.17,30.68 45.47,30.38 45.47,29.6 | 22.76,12.19 CHARGING.8 | CHARGING.15 23.78,9.86 23.78,9.96 23.79,9.97 | C10.1 40.34,11.33 | 40.34,10.47 40.39,10.41 | 6.71,14.2 6.35,14.55 C75.1 | C56.1 19.94,14.82 R39.2 | 17.4,14.29 17.5,14.2 | 48.81,27.9 48.48,27.9 | ADC3.65 48.96,27.42 | ADC3.65 48.38,28 | ADC3.65 49.38,27.86 49.69,27.86 | 48.95,25.24 49.01,25.24 v49.15,25.1 | 14.91,20.35 14.76,20.5 14.84,20.57 | 14.84,20.57 18.88,20.57 28.27,20.57 | 43.17,25.27 42.75,24.86 42.75,20.57 33.41,20.57 29.46,20.57 | 30.16,25.27 28.87,25.27 28.27,24.68 28.27,20.57 | 14.84,20.57 13.85,21.56 13.85,25.35 14.06,25.56 14.14,25.48 15.8,25.48 | v32.62,33.12 32.85,32.89 | 15.8,25.48 ADC1.60 16.9,25.76 17.02,25.88 | 16.15,25.33 16.73,25.33 17.48,24.59 | ADC1.65 18.5,25.48 17.68,25.48 15.8,25.48 | ADC2.65 33.88,28.15 | ADC3.65 47.2,29.18 47.2,31.63 47.19,31.64 | C22.1 3.92,16.59 3.92,15.27 | 11.89,15.22 C20.1 11.87,15.24 | 28.27,20.57 29.46,20.57 | 29.46,20.57 29.84,20.96 29.84,23.32 ADC2.64 | R53.1 28.93,9.35 | C33.1 12.5,24 12.55,24.05 12.55,23.03 R58.2 | 20.48,31.06 20.23,30.82 20.23,30.81 | CHARGING.17 24.31,10.06 24.31,10.74
  Top 0.406: CHARGING.15 23.78,7.25 23.55,7.02 J3.5 | 28.93,9.35 29.14,9.35
  Top 0.508: 22.76,12.19 22.23,12.19 21.35,13.08 C56.1 | C56.1 17.99,12.88 | 8.74,14.2 8.59,14.04 VCC3.3_AN.2 | 5.67,12.57 5.92,12.57 6.71,13.37 6.71,14.2 8.74,14.2 | 14.91,14.2 14.93,14.19 | C56.1 18.19,13.51 17.5,14.2 17.32,14.38 17.4,14.46 C5.1 | VCC3.3_AN.2 | 8.74,14.2 10.77,14.2 | 10.77,14.2 11.76,14.2 | 11.76,14.2 12.6,14.2 | 12.6,14.2 14.91,14.2 | C3.1 12.73,14.33 12.6,14.2 | C57.2 10.9,14.33 10.77,14.2 | 11.87,15.24 11.87,14.3 11.76,14.2 | VCC3.3_AN.2 8.69,12.93 C19.1 | S1.3 13.82,8.03 R49.2 R56.1 | v14.81,11.91 14.83,11.93 14.91,12.02 VCC3.3_DIG.2 14.91,14.2
  Top 0.61: 25.81,10.64 25.81,11.89 26.47,12.54 C55.1
  Top 0.813: C55.1 28.86,12.54 29.14,12.27 29.14,9.35 31.98,9.35 | 40.39,10.41 U2.2 | 14.91,14.38 17.32,14.38 | 14.91,14.38 14.91,14.2 | 14.91,14.38 14.91,20.35
  Route15 0.305: v14.81,11.91 14.81,9.75 v14.18,9.75 | 50.84,37.93 v50.89,37.98 | v43.77,34.42 43.86,34.51 | v32.62,33.12 32.82,33.33 v32.82,37.63 32.79,37.67 | 35.97,37.63 36.26,37.92 | 43.86,37.92 v44.06,37.92 v44.06,37.93
  Route15 0.381: v13.91,39.07 14.69,38.28
  Route15 0.813: 43.86,34.51 43.86,37.92 36.26,37.92 | 32.79,37.67 29.15,37.67 28.54,38.28 v25.18,38.28 14.69,38.28 | v32.82,37.63 35.97,37.63 | v44.06,37.93 50.84,37.93
  Bottom 0.305: C67.1 20.75,25.47 21.49,24.73 | C40.1 18.47,28.19 C31.1 C37.2 | C51.1 21.47,24.77 C83.1 | 20.25,28.43 20.01,28.19 C40.1 | C40.1 20.35,27.48 C39.1 21.16,27.43 v21.16,27.51 | C9.2 23.37,28.52 23.07,28.52 22.53,27.99 22.53,27.53 v22.56,27.51 | C28.2 C25.1 32.82,28.39 33.66,28.39 C30.1 33.41,28.14 v33.41,27.56 v33.41,27.55 | 22.49,27.44 v22.56,27.51 | 21.34,25.86 C51.1 | 35.56,24.79 C64.1 35.54,24.71 | C6.2 37.47,28.93 37.04,28.93 36.72,28.61 v36.72,27.34 | v36.72,27.34 v36.73,27.36 | 34.57,30.35 34.5,30.35 | C69.1 C81.2 | 52.33,28.07 C4.2 | C21.1 49.63,25.71 49.63,26.45 C16.1 | C16.1 49.33,26.75 | 47.45,26.44 C11.2 47.28,26.57 C66.2 | C16.1 50.53,26.67 50.53,28.49 | v49.34,29.66 49.36,29.64 | 18.32,24.38 C32.2 17.66,24.38 v17.45,24.59 | 32.27,30.28 C15.2 32.54,30.28 | 51.62,25.4 51.82,25.19 C14.2 | C12.1 37.23,26.5 37.11,26.5 36.72,26.89 v36.72,27.34 | C13.1 23.26,26.1 23.14,26.1 22.56,26.68 v22.56,27.51 | v47.39,30.71 47.86,30.24 | v18.93,30.84 18.27,30.18 C18.2 | C78.2 31.68,27.08 | C86.2 17.48,27.2 17.05,27.64 v16.97,27.64 | C26.2 31.46,24.25 v31.26,24.46 | C1.2 46.33,24.13 v45.5,24.13 | ESD7.2 12.12,29.74 v13.14,30.76 | v50.89,37.98 50.89,37.95 50.92,37.92 51.86,37.92 ESD6.2 | ESD4.2 33.1,37.82 32.77,37.49 32.77,37.47 32.82,37.53 v32.82,37.63 | ESD3.2 25.46,37.77 25.12,38.1 25.12,38.23 v25.18,38.28 | ESD2.2 13.85,48.57 13.97,48.69 14.58,48.69 15.65,47.63 15.65,42.04 14.57,40.96 14.1,40.96 13.92,40.78 13.92,40.25 ESD1.2 13.91,40.16 13.91,39.18 13.9,39.17 v13.9,39.07 v13.91,39.07 | C73.1 C71.2 | C71.2 35.35,30.29 | C71.2 C27.2 35.31,27.43 C24.1 | C82.1 21.34,30.05 C87.2 21.47,29.29 C38.2 | v44.06,37.92 45.41,37.92 ESD5.2
  Bottom 0.381: C4.2 52.38,28.7 v52.33,28.75 | C18.2 18.12,30.76 C85.1 17.78,33.52 18.99,34.72 19.02,34.72 19.06,34.68 19.18,34.68 19.88,33.97 19.88,31.74 20.23,31.39 20.23,30.11 20.19,30.07 C82.1 | C37.2 18.32,27.36 17.66,27.36 17.66,27.13 C86.2 | C84.1 17.61,28.19 18.47,28.19 | C77.1 31.55,28.09 C25.1 | C21.1 49.97,25.37 C70.1 C79.1 49.13,25.08 v49.15,25.1 | C16.1 49.75,27.01 49.75,27.6 49.64,27.71 C17.1 47.48,27.71 C2.1 46.74,27.73 46.47,27.73 C68.1 | 46.38,26.62 C66.2 46.44,27.59 C68.1 | v45.71,28.28 45.77,28.28 45.83,28.22 45.83,27.92 46.03,27.73 46.3,27.73 C68.1 | C65.1 47.24,30.86 47.42,30.68 | 47.86,30.24 C7.2 | 31.68,27.08 31.71,27.1 32.49,27.1 C28.2 | C74.1 32.31,30.33 32.27,30.28 | C69.1 49.41,29.72 v49.34,29.66 49.75,29.25 50.43,29.25 C8.2 50.52,28.5 50.53,28.49 | 20.25,28.43 20.85,29.03 C38.2 | v21.16,27.51 21.16,26.03 C51.1 | C24.1 34.6,26.09 34.41,25.9 | 34.41,25.9 C72.1 | 34.41,25.9 35.42,25.9 C29.1 35.56,24.79 | 32.54,30.28 v33.13,30.28 | C73.1 34.5,30.4 v34.5,30.97
  other vias: 19.33,38.99 39.83,35.97 38.23,39.09 1.88,29.54 57.48,32.44 35.92,49.07 5.77,49.35 10.67,21.08 18.45,19.84 24.97,20.3 33,20.37 39.25,20.45 47.1,19.58
  pour Top: 29.32,15.17 29.32,12.04 29.98,11.38 43.62,11.38 43.62,8.26 43.44,8.08 29.88,8.08 29.77,8.18 29.77,1.22 0.67,1.22 0.67,15.95 1.71,16.99 10.93,16.99 10.93,11.61 16.59,11.61 16.62,16.97 18.01,16.97 19.03,15.95 28.54,15.95
  pour Top: 1.46,50.69 0.59,49.82 0.59,27.15 7.47,27.15 11.94,27.2 11.99,27.15 11.99,27.13 12.02,27.1 12.02,21.03 10.67,21.03 7.7,18.06 47.56,18.06 53.29,23.42 53.31,26.69 54.85,28.23 57.1,28.23 57.1,50.7 1.45,50.7
  pour Bottom: 1.41,50.64 0.51,49.74 0.51,27.2 7.45,27.2 11.97,27.16 11.97,21.84 8.82,21.82 7.5,20.5 7.5,17.91 7.57,17.83 12.4,17.83 13.44,18.87 13.67,18.87 13.8,18.75 27.49,18.75 28.38,17.86 42.24,17.86 47.38,17.91 53.24,23.4 53.26,26.64 54.67,28.04 58.48,28.04 58.48,49.3 57.13,50.65 1.4,50.65
  pour Route2: 1.51,50.64 0.64,49.76 0.64,27.2 7.55,27.2 7.6,27.15 13.42,27.2 13.47,27.15 13.47,21.84 13.49,21.82 8.54,21.82 7.6,20.88 7.6,17.91 47.48,17.91 53.34,23.4 53.36,26.64 54.92,28.19 58.35,28.19 58.35,49.43 57.13,50.65 1.5,50.65
  pour Bottom: 7.04,20.47 1.63,20.47 0.74,19.58 0.74,13.31 1.45,12.6 6.2,12.6 6.84,11.96 6.84,11.23 9.48,8.59 15.91,8.59 16.46,9.14 23.27,9.14 26.29,12.17 27.11,12.17 29.37,9.91 29.37,7.32 25.71,3.66 1.25,3.66 0.74,3.15 0.74,0.76 1.15,0.36 1.15,0.31 16.69,0.31 17.28,0.89 27.28,0.89 27.92,0.25 49.48,0.31 49.48,15.95 26.6,15.95 26.14,16.41 7.85,16.41 7.04,17.22
AGND-SUBJECTGROUND
  Top 0.381: R45.1 3.33,23.65 SUBJECT_GND.MP
  Bottom 0.381: ESD7.1 9.99,30.24 9.78,30.02 9.78,28.95 5.23,24.41 SUBJECT_GND.MP
  pour Top: 0.6,18.75 0.6,26.57 6.25,26.57 6.25,22.18 4.5,22.18 4.5,18.75
CS_ADC1  (via drill 0.38)
  Top 0.152: ADC3.18 53.48,24.11 53.95,24.11 v54.31,23.75 | v49.52,13.96 49.27,13.71 48.37,13.71 48.19,13.54 48.19,10.16 48.67,9.68 50.2,9.68 BC832.A4
  Route15 0.152: v49.52,13.96 50.48,14.92 53.57,14.92 54.03,15.38 54.03,23.47 v54.31,23.75
CS_ADC2  (via drill 0.38)
  Top 0.152: ADC2.18 39.18,24.05 39.67,24.05 v39.98,23.74 | v47.63,12.85 47.89,12.59 47.89,9.9 48.65,9.14 BC832.A5
  Route15 0.152: v39.98,23.74 40.4,23.32 40.4,13.61 41.04,12.96 47.52,12.96 v47.63,12.85
CS_ADC3  (via drill 0.38)
  Top 0.152: ADC1.18 25.1,24.13 25.5,24.13 25.83,23.8 25.96,23.8 25.9,23.74 v25.9,23.71 | BC832.C1 53.72,6.12 52.63,6.12 v52.56,6.05
  Route2 0.152: v52.56,6.05 52.56,6.56 52.08,7.04 50.69,7.04 49.99,7.74 45.58,7.74 45.12,7.28 43.14,7.28 42.68,7.75 42.68,7.72 v42.71,7.69
  Route15 0.152: v25.9,23.71 26.31,23.31 26.31,18.31 27.91,16.71 29.47,16.71 38.26,7.93 42.47,7.93 v42.71,7.69
DGND  (via drill 0.38, 0.85)  (1 unrouted)
  Top 0.152: 51.72,22.96 ADC3.14
  Top 0.305: ADC3.31 54.82,30.68 55.96,29.54 55.96,26.18 | ADC2.31 40.06,30.66 40.97,29.74 40.97,26.16 | ADC1.31 25.63,30.76 27.02,29.37 27.02,27.92 27.24,27.7 27.24,26.86 | 27.24,26.86 27.24,26.26 | 41.61,26.16 43.14,27.69 ADC3.56 | ADC2.56 28.04,27.66 27.24,26.86 | ADC1.56 14.33,27.76 13.16,26.59 13.16,19.8 13.41,19.56 13.41,17.49 13.14,17.22 v13.16,17.2
  Top 0.381: R39.1 23.02,16.42 23.37,16.77 | 23.19,16.77 23.37,16.77 | ADC3.16 ADC3.15 ADC3.14 ADC3.13 | ADC3.16 51.84,22.98 | ADC1.22 27.24,26.26 27.24,23.06 ADC1.16 ADC1.15 ADC1.14 22.92,23.06 22.78,22.91 ADC1.13 23.19,22.64 v23.19,22.02 | ADC2.22 40.97,26.16 41.61,26.16 41.61,22.96 ADC2.16 ADC2.15 ADC2.14 ADC2.13 37.2,22.96 37.37,22.79 v37.37,21.97 | ADC3.22 55.96,26.18 55.96,22.98 ADC3.16 | 23.19,18.34 23.27,18.34 23.19,18.42 | 23.37,16.77 28.81,16.77 30.86,14.72 30.86,13.57 RESET.2 33.85,12.84 CLOCK.2 37.42,13.62 37.42,15.42 51.72,15.42 51.72,20.12 56.34,20.12 57.34,19.12 BC832.1 | v37.44,18.59 37.42,18.57 | v32.72,7.57 32.82,7.67 J1.9
  Top 0.406: 51.72,20.12 51.72,22.96
  Top 0.61: 23.19,18.34 23.19,16.77 | 23.19,18.42 23.19,19.88 v23.22,19.91 | 37.42,18.57 37.42,15.42
  Top 0.813: RESET.2 v32.72,10.69
  Route15 0.305: v13.16,17.2 20.51,17.2 v23.22,19.91
  Bottom 0.381: v23.22,19.91 23.17,19.96 | 23.17,22.02 v23.19,22.02 | 37.37,18.59 v37.44,18.59
  Bottom 0.61: 23.17,22.02 23.17,19.96 | v37.37,21.97 37.37,18.59
  Bottom 0.813: v32.72,10.69 v32.72,7.57 32.72,7.54
  other vias: 43.18,1.78
  pour Top: 30.76,11.92 44.18,11.92 44.18,7.27 43.87,6.96 30.43,7.01 30.38,1.68 31.42,0.64 45.39,0.64 45.48,15.07 57.84,15.11 57.84,20.78 55.73,22.89 53.34,22.89 48.01,17.56 31.17,17.58 19.18,17.55 19.16,17.53 19.16,16.97 19.56,16.56 28.7,16.56 30.79,14.26 30.76,12.7
  pour Route2: 45.32,17.2 45.32,1.17 44.43,0.28 8.51,0.28 8.51,13.77 12.04,17.3 13.14,17.3 14.15,16.28 29.49,16.33 30.36,17.2
DRDY_ADC1  (via drill 0.38)
  Top 0.152: ADC3.30 53.85,30.18 v54.49,29.54 | v49.08,12.57 49,12.5 48.82,12.5 48.8,12.47 48.8,10.41 48.92,10.29 51.22,10.29 51.84,9.67 52.16,9.67 52.68,9.14 BC832.A2
  Route15 0.152: v54.49,29.54 54.25,29.31 54.25,26.61 54.8,26.07 55.52,26.07 55.89,25.7 55.89,23.28 55.24,22.63 55.24,14.88 54.07,13.71 51.44,13.71 51.44,13.48 50.77,12.81 49.31,12.81 v49.08,12.58 v49.08,12.57
DRDY_ADC2  (via drill 0.38)
  Top 0.152: ADC2.30 39.75,30.16 40.04,29.87 v40.04,29.65 | v51.36,6.12 51.32,6.12 BC832.D4
  Route2 0.152: v51.36,6.12 51.34,6.15 43.48,6.15 42.17,7.46 42.17,7.91 43.13,8.88 43.13,14.26 v43.61,14.74
  Route15 0.152: v40.04,29.65 40.04,28.55 40.77,27.82 40.77,26.59 40.74,26.55 40.74,26.41 41.61,25.53 41.61,14.3 41.71,14.2 43.07,14.2 v43.61,14.74
DRDY_ADC3  (via drill 0.38)
  Top 0.152: ADC1.30 25.45,30.26 25.87,29.84 v25.87,29.46 | v53.67,8.59 53.65,8.59 53.65,8.18 53.67,8.16 53.67,8.09 53.81,7.94 BC832.B1
  Route2 0.152: v53.67,8.59 52.84,8.59 51.89,7.64 50.94,7.64 50.22,8.37 45.35,8.37 45.11,8.13 44.66,8.13 44.12,8.67 44.12,9.67 44.25,9.81 44.25,10.19 v44.28,10.19
  Route15 0.152: v25.87,29.46 25.87,28.83 26.78,27.91 26.78,27.32 27.54,26.56 27.54,18.79 28.41,17.92 29.97,17.92 38.75,9.14 43.24,9.14 v44.28,10.19
MEASURE_VBATM  (via drill 0.38)
  Top 0.152: R55.1 17.94,8.91 17.94,8.43 18.55,7.82 20.04,7.82 v20.58,7.28 | ADC2.63 29.75,24.16 29.19,23.6 v29.19,21.23 v29.18,21.23
  Top 0.305: R55.1 R56.2
  Route2 0.152: v20.58,7.28 20.58,7.41 29.18,16.02 v29.18,21.23
MEASURE_VUSB  (via drill 0.38)
  Top 0.152: 16.38,8.03 17.15,8.03 17.3,7.87 | 17.3,7.87 17.66,7.52 19.56,7.52 19.56,7.4 v19.69,7.27 | R57.1 18.06,7.09 17.28,7.87 17.3,7.87 | R49.1 16.38,8.03 | ADC1.63 15.99,24.18 15.6,24.18 15.05,23.63 15.05,21.33 15.32,21.06 15.4,21.13 v15.4,21.23 | v16.81,8.45 16.38,8.03
  Route2 0.152: v15.4,21.23 15.4,12.63 16.34,11.68 16.34,8.7 16.64,8.41 16.76,8.41 v16.81,8.45
N$1  (via drill 0.38)
  Top 0.152: ADC3.59 44.48,26.16 43.62,26.16 v43.62,26.04
  Bottom 0.152: C1.1 46.26,24.97 45.09,26.14 43.72,26.14 v43.62,26.04
N$2  (via drill 0.38)
  Top 0.152: ADC2.23 39.16,26.74 39.8,26.74 40.06,26.99 v40.23,26.82
  Bottom 0.152: v40.23,26.82 37.83,26.82 C12.2
N$3
  Top 0.381: D1.2 3.24,16.6 C22.2 3.23,18.05 R45.2
N$4
  Top 0.381: VCC3.3_DIG.4 16.13,15.9 C5.2
N$6
  Top 0.152: BC832.2 56.24,15.25 LED1.1
  Top 0.305: LED1.1
N$7
  Top 0.305: ADC3.64 ADC3.63
N$8  (via drill 0.38)  (1 unrouted)
  Top 0.152: v42.9,30.52 43.15,30.27 44.4,30.27
  Bottom 0.152: C7.1 46.41,30.2 43.22,30.2 v42.9,30.52
N$10
  Top 0.152: LED3.2 54.33,18.17 R68.1
N$11
  Top 0.152: LED1.2 56.27,17.84 R69.1
N$12
  Top 0.381: LED4.2 25.61,14.15 26.22,14.76 R41.1
N$13  (via drill 0.38)
  Top 0.152: ADC2.51 30.1,30.23 29.1,30.23 v28.7,30.63
  Bottom 0.152: C15.1 31.08,30.26 29.43,30.26 29.06,30.63 v28.7,30.63
N$14  (via drill 0.38)
  Top 0.152: ADC3.23 54.87,26.69 54.91,26.73 v54.8,26.84
  Bottom 0.152: C14.1 52.94,26.67 54.63,26.67 v54.8,26.84
N$16  (via drill 0.38)
  Top 0.152: ADC1.23 26.33,26.76 26.42,26.85 v26.42,26.91
  Bottom 0.152: v26.42,26.91 26.2,26.7 C13.2
N$17
  Top 0.381: R43.1 27.26,16.05 LED2.2
N$19
  Top 0.406: C57.1 9.83,15.93 VCC3.3_AN.4
N$21  (via drill 0.38)
  Top 0.152: 15.59,26.26 ADC1.59 15.24,26.26 15.15,26.16 v15.15,26.14
  Bottom 0.152: C32.1 17.3,25.3 16.36,26.24 15.25,26.24 v15.15,26.14
N$22  (via drill 0.38)
  Top 0.152: ADC2.59 30.15,26.14 29.46,26.14 v29.31,25.99
  Bottom 0.152: C26.1 30.12,25.17 v29.31,25.99
N$26  (via drill 0.38)
  Top 0.152: ADC1.51 14.46,30.26 v14.42,30.22
  Bottom 0.152: C18.1 17.1,30.28 14.48,30.28 v14.42,30.22
N$39  (via drill 0.38)
  Top 0.152: CHARGING.1 25.4,8.1 25.66,8.1 v25.68,8.13 | v26.75,6.25 26.75,5.98 27.32,5.41 27.33,5.41 R65.2 27.61,3.64 R62.1
  Route2 0.152: v25.68,8.13 26.78,7.04 26.78,6.27 v26.75,6.25
N$58
  Top 0.305: R53.2 27.54,6.93 24.59,6.93 24.29,7.24 CHARGING.16
N$60
  Top 0.305: CHARGING.12 20.52,8.51 R51.2
P18/LED  (via drill 0.38)
  Top 0.152: LED3.1 52.95,13.56 v52.95,13.12 52.49,12.66 52.94,12.22 BC832.5 | J1.6 37.23,4.28 37.23,5.1 37.66,5.53 39.73,5.53 40.14,5.13 v40.82,5.13
  Route15 0.152: v52.95,13.12 51.41,11.58 49.23,11.58 49.23,5.56 49.31,5.48 49.31,5.03 49,4.71 41.94,4.71 41.52,5.13 v40.82,5.13
POWERUP  (via drill 0.38)